# EAGLE schematic ENERGIS_Rack-PDU_1.0.0 (EAGLE 9.2.1)

## Sheet 1 of 6: MICROCONTROLLER
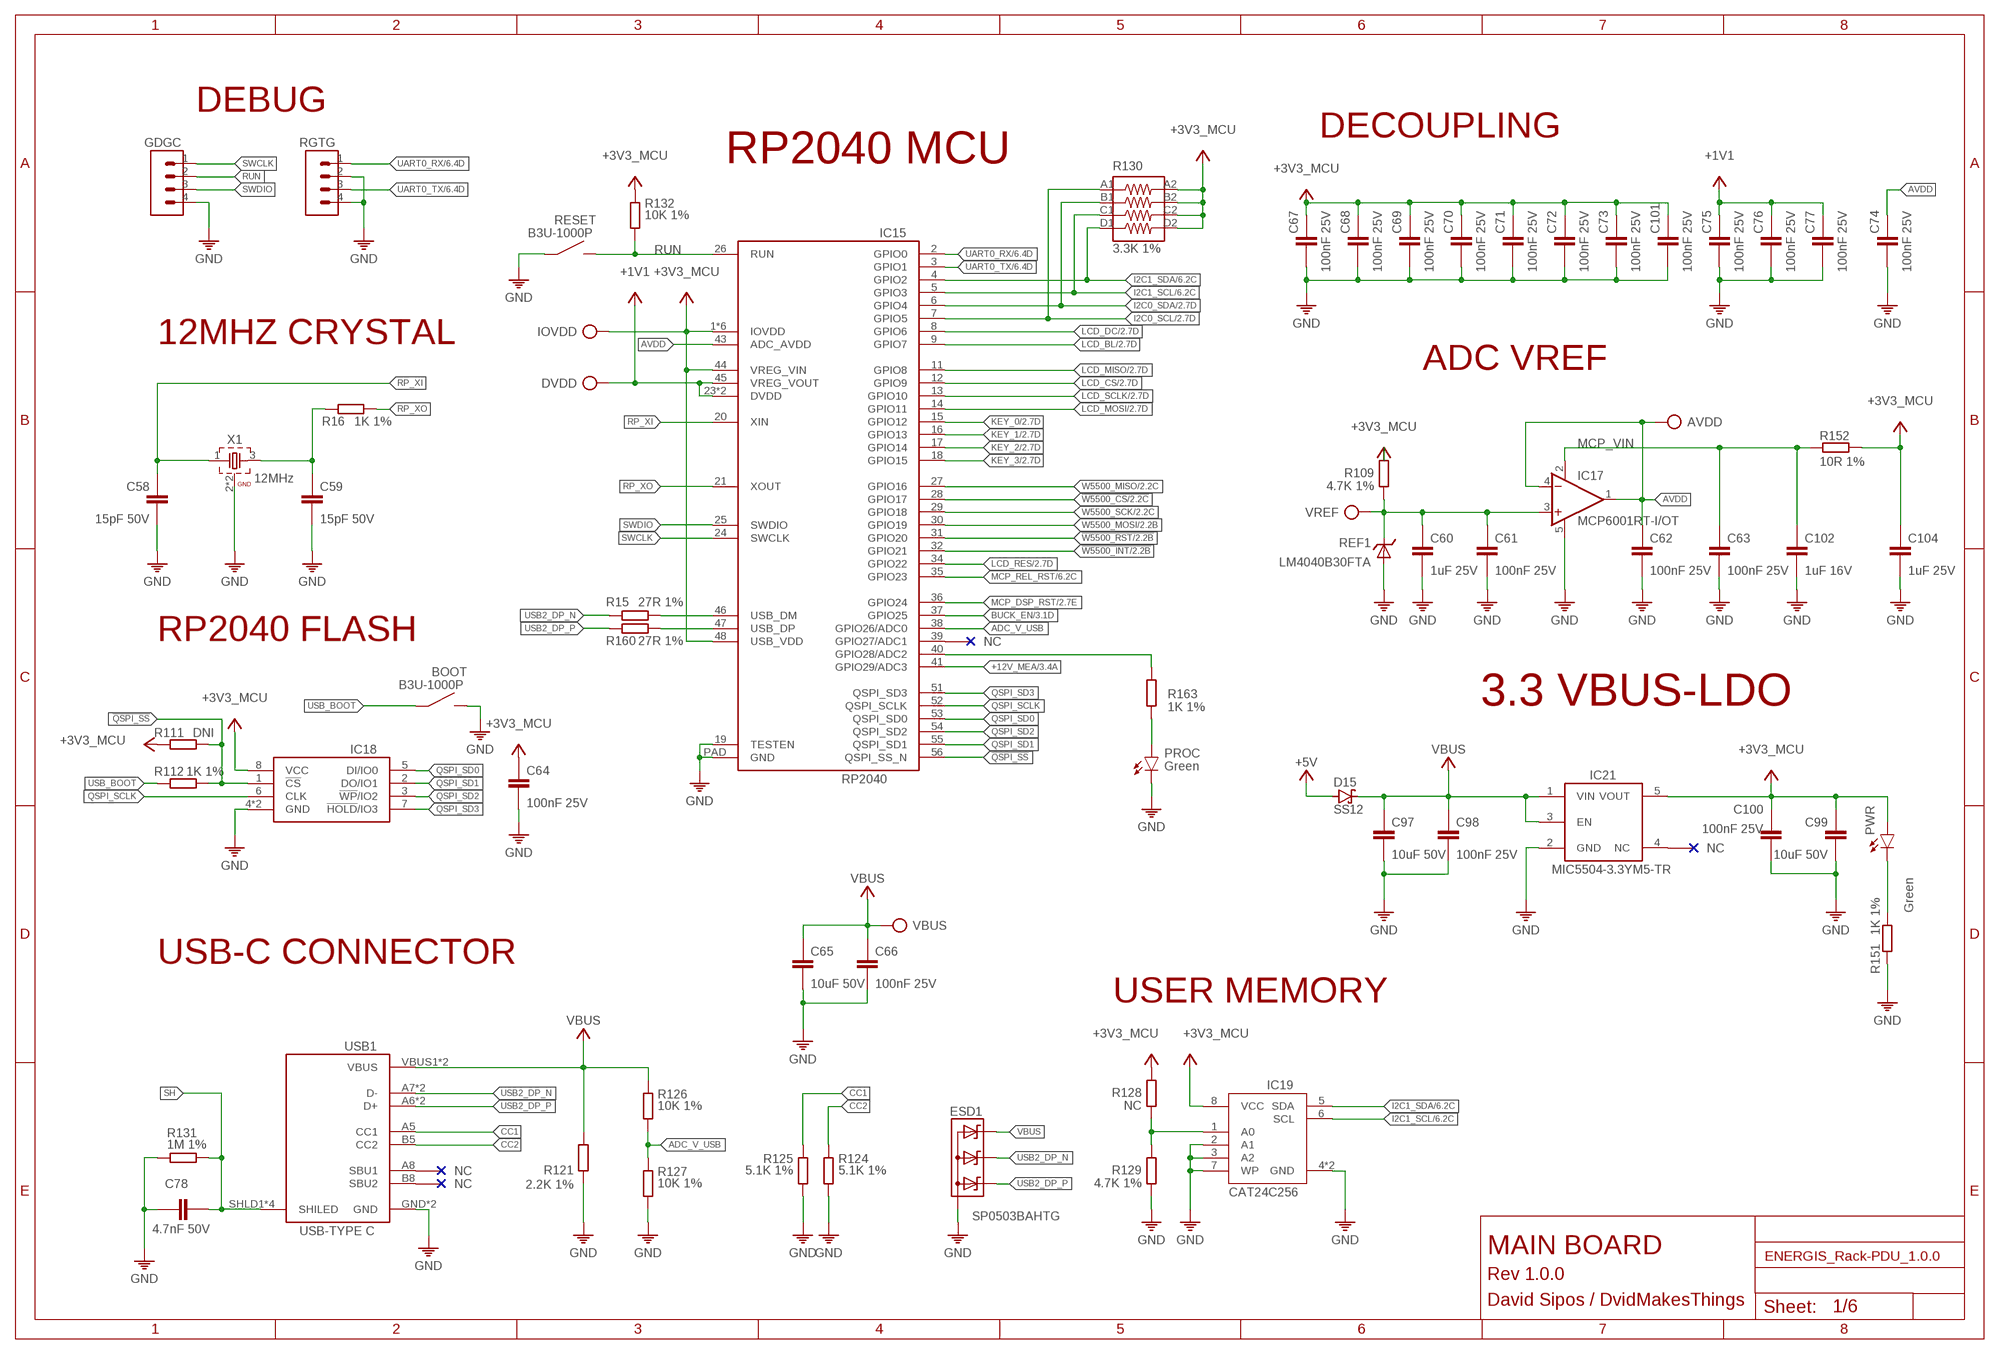
[diagram p0: schematic, sheet 1]

### Parts
AVDD  TP  [TP]
BOOT  B3U-1000P  B3U-1000P  [B3U-1000P]
C58  15pF 50V  15PF-50V0201  [0201]
C59  15pF 50V  15PF-50V0201  [0201]
C60  1uF 25V  1UF-25V0402  [0402]
C61  100nF 25V  100NF-25V-0201  [0201]
C62  100nF 25V  100NF-25V-0201  [0201]
C63  100nF 25V  100NF-25V-0201  [0201]
C64  100nF 25V  100NF-25V-0201  [0201]
C65  10uF 50V  10UF-50V-0805  [0805]
C66  100nF 25V  100NF-25V-0402  [0402]
C67  100nF 25V  100NF-25V-0201  [0201]
C68  100nF 25V  100NF-25V-0201  [0201]
C69  100nF 25V  100NF-25V-0201  [0201]
C70  100nF 25V  100NF-25V-0201  [0201]
C71  100nF 25V  100NF-25V-0201  [0201]
C72  100nF 25V  100NF-25V-0201  [0201]
C73  100nF 25V  100NF-25V-0201  [0201]
C74  100nF 25V  100NF-25V-0201  [0201]
C75  100nF 25V  100NF-25V-0201  [0201]
C76  100nF 25V  100NF-25V-0201  [0201]
C77  100nF 25V  100NF-25V-0201  [0201]
C78  4.7nF 50V  4.7NF-50V0402  [0402]
C97  10uF 50V  10UF-50V-0805  [0805]
C98  100nF 25V  100NF-25V-0201  [0201]
C99  10uF 50V  10UF-50V-0805  [0805]
C100  100nF 25V  100NF-25V-0201  [0201]
C101  100nF 25V  100NF-25V-0201  [0201]
C102  1uF 16V  1UF-16V0201  [0201]
C104  1uF 25V  1UF-25V0402  [0402]
D15  SS12  [SMA/DO-214AC]
DVDD  TP  [TP]
ESD1  SP0503BAHTG  SP0503BAHT  [SOT143]
GDGC  CON-1X4  [1X4]
IC15  RP2040  [QFN56]
IC17  MCP6001RT-I/OT  MCP6001RT  [SOT23-5]
IC18  W25Q128JVPIQ  W25Q128JVP  [SON127P600X500X75-8N]
IC19  CAT24C256HU4IGT3  CAT24C256-HU4  [SON50P300X200X50-9T130X140N]
IC21  MIC5504-3.3YM5  MIC5504-3.3YM5-TR  [SOT23-5]
IOVDD  TP  [TP]
PROC  Green  LED-GREENLED-0603  [LED-0603]
PWR  Green  LED-GREENLED-0603  [LED-0603]
R15  27R 1%  27R-1%0201  [0201]
R16  1K 1%  1K-1%0201  [0201]
R109  4.7K 1%  4.7K-1%0201  [0201]
R111  DNI  R0201  [R0201]
R112  1K 1%  1K-1%0402  [0402]
R121  2.2K 1%  2.2K-1%0201  [0201]
R124  5.1K 1%  5.1K-1%0201  [0201]
R125  5.1K 1%  5.1K-1%0201  [0201]
R126  10K 1%  10K-1%0201  [0201]
R127  10K 1%  10K-1%0201  [0201]
R128  NC  R0201  [R0201]
R129  4.7K 1%  4.7K-1%0201  [0201]
R130  3.3K 1%  3.3K-1%_ARRAY0603X4-1206  [_0603X4-1206]
R131  1M 1%  1M-1%0402  [0402]
R132  10K 1%  10K-1%0402  [0402]
R151  1K 1%  1K-1%0402  [0402]
R152  10R 1%  10R-1%0201  [0201]
R160  27R 1%  27R-1%0201  [0201]
R163  1K 1%  1K-1%0402  [0402]
REF1  LM4040B30FTA  LM4040BXX  [SOT23]
RESET  B3U-1000P  B3U-1000P  [B3U-1000P]
RGTG  CON-1X4  [1X4]
USB1  USB-TYPE-C-018  USB_C-THT  [USB-C]
VBUS  TP  [TP]
VREF  TP  [TP]
X1  12MHz  CRYSTAL-3225X322512MSB4SI  [WE-XTAL_CFPX-180]

### Nets
!QSPI_SS: IC15.56(QSPI_SS_N) IC18.1(!CS) R111.1 R112.2
!W5500_CS: IC15.28(GPIO17) ; also sheet 2
!W5500_INT: IC15.32(GPIO21) ; also sheet 2
!W5500_RST: IC15.31(GPIO20) ; also sheet 2
+1V1: C75.1 C76.1 C77.1 DVDD.TP IC15.23(DVDD) IC15.45(VREG_VOUT) IC15.50(DVDD)
+3V3_MCU: C64.1 C67.1 C68.1 C69.1 C70.1 C71.1 C72.1 C73.1 C99.1 C100.1 C101.1 C104.1 IC15.1(IOVDD) IC15.10(IOVDD) IC15.22(IOVDD) IC15.33(IOVDD) IC15.42(IOVDD) IC15.44(VREG_VIN) IC15.48(USB_VDD) IC15.49(IOVDD) IC18.8(VCC) IC19.8(VCC) IC21.5(VOUT) IOVDD.TP PWR.A R109.2 R111.2 R128.2 R130.A2 R130.B2 R130.C2 R130.D2 R132.1 R152.1
+5V: D15.A ; also sheet 2,3
+12V_MEA: IC15.41(GPIO29/ADC3) ; also sheet 3
ADC_V_USB: IC15.38(GPIO26/ADC0) R126.2 R127.1
AVDD: AVDD.TP C62.1 C74.1 IC15.43(ADC_AVDD) IC17.1(OUT) IC17.4(-IN)
BUCK_EN: IC15.37(GPIO25) ; also sheet 3
CC1: R125.1 USB1.A5(CC1)
CC2: R124.1 USB1.B5(CC2)
GND: BOOT.2 C58.2 C59.2 C60.2 C61.2 C62.2 C63.2 C64.2 C65.2 C66.2 C67.2 C68.2 C69.2 C70.2 C71.2 C72.2 C73.2 C74.2 C75.2 C76.2 C77.2 C78.2 C97.2 C98.2 C99.2 C100.2 C101.2 C102.2 C104.2 ESD1.1(A) GDGC.4 IC15.19(TESTEN) IC15.PAD(GND) IC17.5(V-) IC18.4(GND) IC18.PAD(GND) IC19.2(A1) IC19.3(A2) IC19.4(GND) IC19.7(WP) IC19.9(GND) IC21.2(GND) PROC.C R121.2 R124.2 R125.2 R127.2 R129.1 R131.2 R151.1 REF1.2(A) REF1.3(A) RESET.1 RGTG.2 RGTG.4 USB1.GND USB1.GND2(GND) X1.2(GND) X1.4(GND) ; also sheet 2,3,6
I2C0_SCL: IC15.7(GPIO5) R130.A1 ; also sheet 2
I2C0_SDA: IC15.6(GPIO4) R130.B1 ; also sheet 2
I2C1_SCL: IC15.5(GPIO3) IC19.6(SCL) R130.C1 ; also sheet 6
I2C1_SDA: IC15.4(GPIO2) IC19.5(SDA) R130.D1 ; also sheet 6
KEY_0: IC15.15(GPIO12) ; also sheet 2
KEY_1: IC15.16(GPIO13) ; also sheet 2
KEY_2: IC15.17(GPIO14) ; also sheet 2
KEY_3: IC15.18(GPIO15) ; also sheet 2
LCD_BL: IC15.9(GPIO7) ; also sheet 2
LCD_CS: IC15.12(GPIO9) ; also sheet 2
LCD_DC: IC15.8(GPIO6) ; also sheet 2
LCD_MISO: IC15.11(GPIO8) ; also sheet 2
LCD_MOSI: IC15.14(GPIO11) ; also sheet 2
LCD_RES: IC15.34(GPIO22) ; also sheet 2
LCD_SCLK: IC15.13(GPIO10) ; also sheet 2
MCP_DSP_RST: IC15.36(GPIO24) ; also sheet 2
MCP_REL_RST: IC15.35(GPIO23) ; also sheet 6
MCP_VIN: C63.1 C102.1 IC17.2(V+) R152.2
N$17: IC15.40(GPIO28/ADC2) R163.2
N$19: PROC.A R163.1
N$53: C59.1 R16.1 X1.3
N$54: IC19.1(A0) R128.1 R129.2
N$112: PWR.C R151.2
QSPI_SCLK: IC15.52(QSPI_SCLK) IC18.6(CLK)
QSPI_SD0: IC15.53(QSPI_SD0) IC18.5(DI/IO0)
QSPI_SD1: IC15.55(QSPI_SD1) IC18.2(DO/IO1)
QSPI_SD2: IC15.54(QSPI_SD2) IC18.3(!WP!/IO2)
QSPI_SD3: IC15.51(QSPI_SD3) IC18.7(!HOLD!/IO3)
RP_DP_N [90R_DIFFPAIR]: IC15.46(USB_DM) R15.2
RP_DP_P [90R_DIFFPAIR]: IC15.47(USB_DP) R160.2
RP_XI: C58.1 IC15.20(XIN) X1.1
RP_XO: IC15.21(XOUT) R16.2
RUN: GDGC.2 IC15.26(RUN) R132.2 RESET.2
SH: C78.1 R131.1 USB1.SHLD1(SHILED) USB1.SHLD2(SHILED) USB1.SHLD3(SHILED) USB1.SHLD4(SHILED) ; also sheet 2
SWCLK: GDGC.1 IC15.24(SWCLK)
SWDIO: GDGC.3 IC15.25(SWDIO)
UART0_RX: IC15.2(GPIO0) RGTG.1 ; also sheet 6
UART0_TX: IC15.3(GPIO1) RGTG.3 ; also sheet 6
USB2_DP_N [90R_DIFFPAIR]: ESD1.3(C2) R15.1 USB1.A7(D-) USB1.B7(D-)
USB2_DP_P [90R_DIFFPAIR]: ESD1.2(C1) R160.1 USB1.A6(D+) USB1.B6(D+)
USB_BOOT: BOOT.1 R112.1
VBUS: C65.1 C66.1 C97.1 C98.1 D15.C ESD1.4(C3) IC21.1(VIN) IC21.3(EN) R121.1 R126.1 USB1.VBUS1(VBUS) USB1.VBUS2(VBUS) VBUS.TP
VREF: C60.1 C61.1 IC17.3(+IN) R109.1 REF1.1(C) VREF.TP
W5500_MISO: IC15.27(GPIO16) ; also sheet 2
W5500_MOSI: IC15.30(GPIO19) ; also sheet 2
W5500_SCK: IC15.29(GPIO18) ; also sheet 2
Unconnected: IC15.39(GPIO27/ADC1) IC21.4(NC) USB1.A8(SBU1) USB1.B8(SBU2)

### Notes on the sheet
- DEBUG
- DECOUPLING
- RP2040 MCU
- 12MHZ CRYSTAL
- ADC VREF
- RP2040 FLASH
- 3.3 VBUS-LDO
- USB-C CONNECTOR
- USER MEMORY
- MAIN BOARD
- Rev 1.0.0
- David Sipos / DvidMakesThings

## Sheet 2 of 6: NETWORK AND CONNECTORS
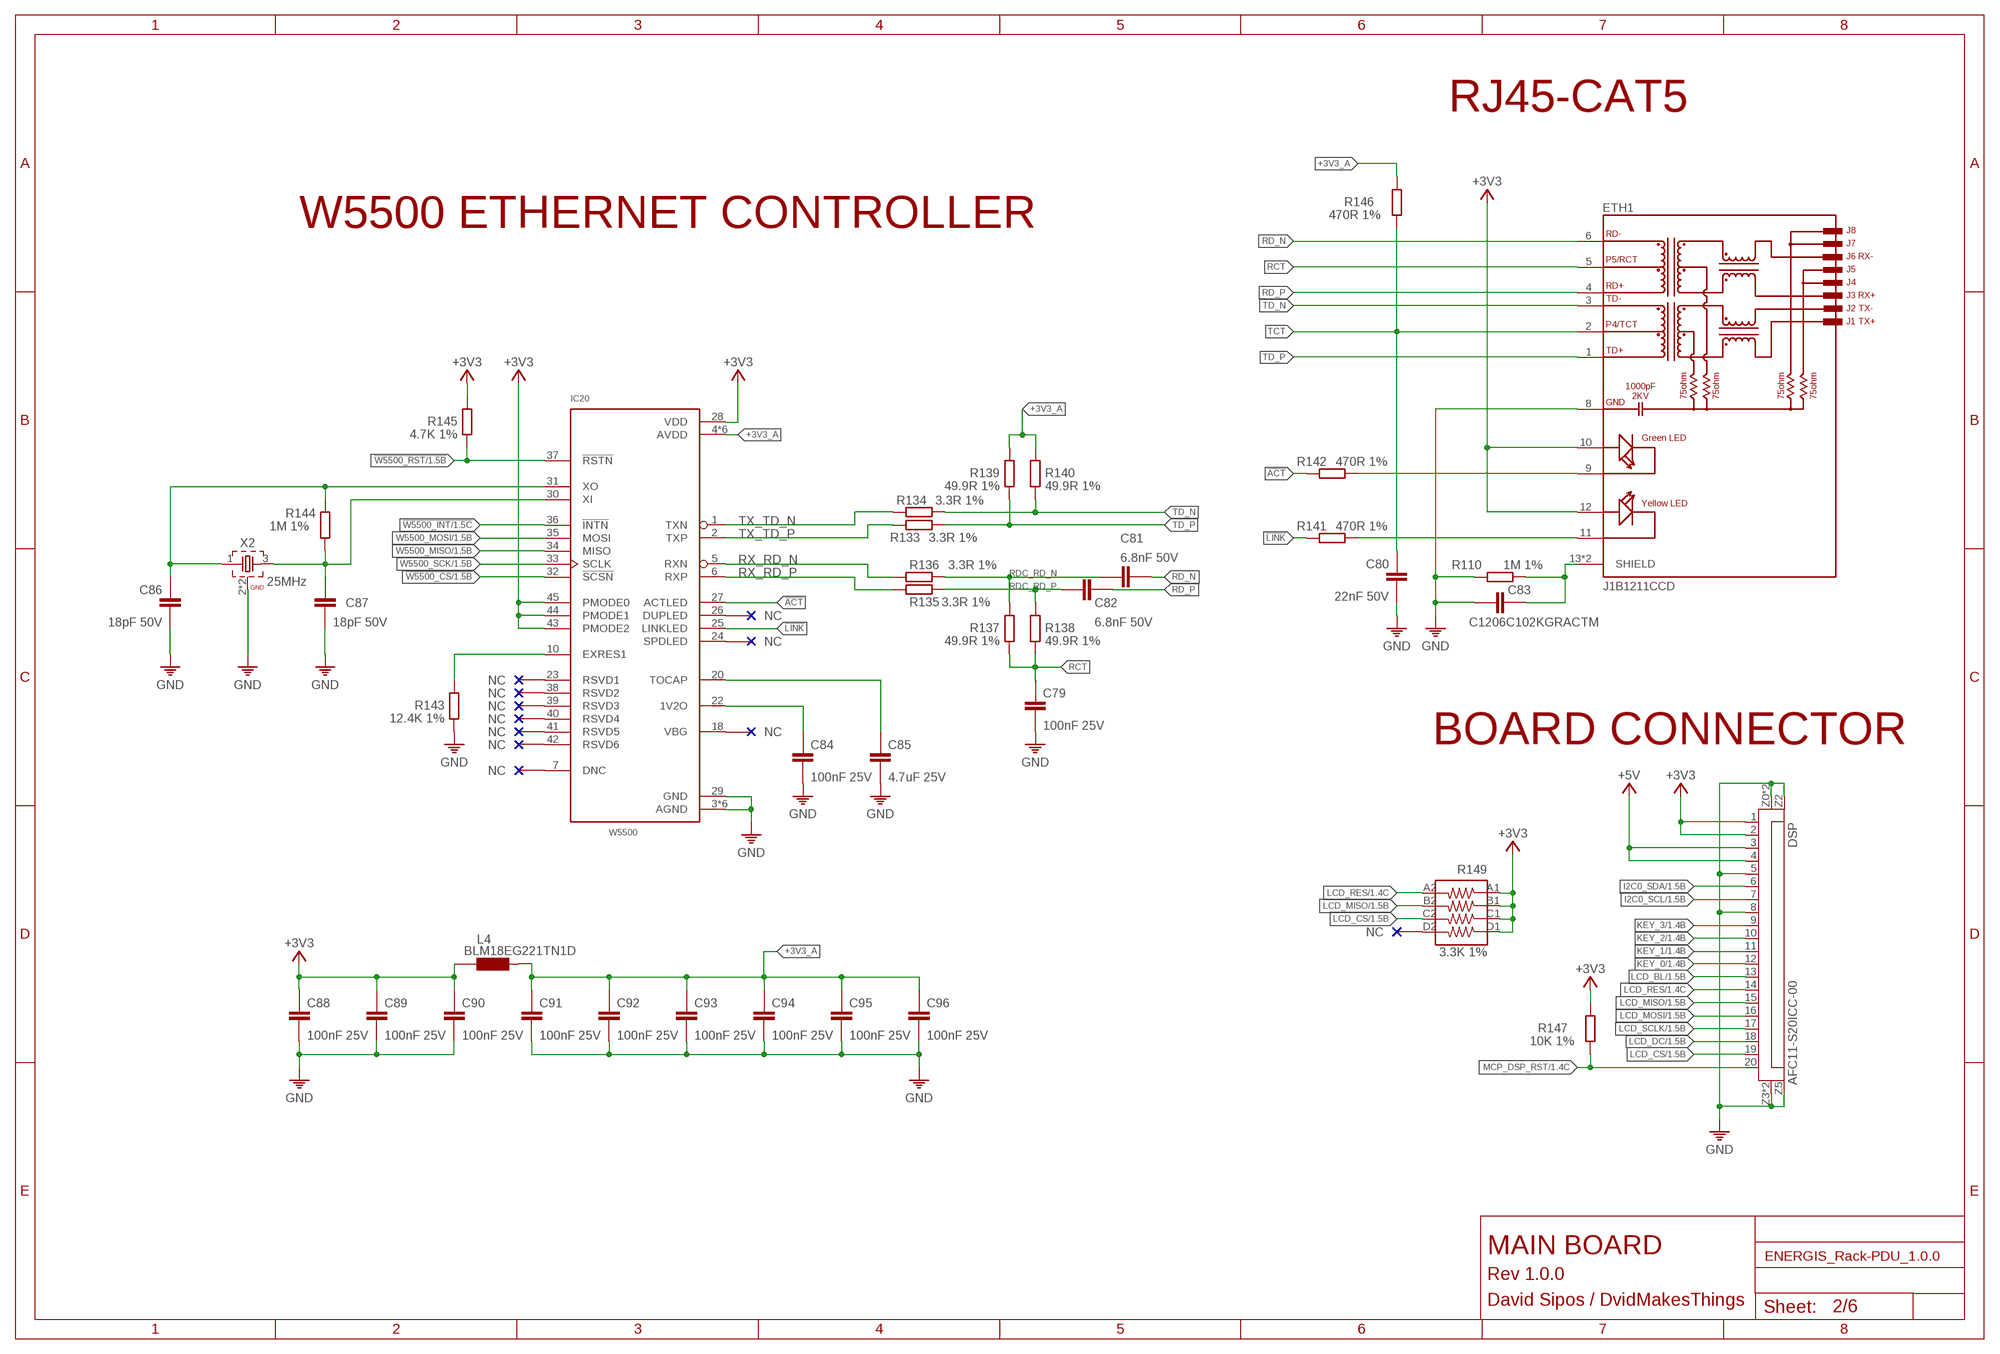
[diagram p1: schematic, sheet 2]

### Parts
C79  100nF 25V  100NF-25V-0402  [0402]
C80  22nF 50V  22NF-50V0402  [0402]
C81  6.8nF 50V  6.8NF-50V0201  [0201]
C82  6.8nF 50V  6.8NF-50V0201  [0201]
C83  C1206C102KGRACTM  C-1206  [C1206]
C84  100nF 25V  100NF-25V-0201  [0201]
C85  4.7uF 25V  4.7UF-25V0402  [0402]
C86  18pF 50V  18PF-50V-0201  [0201]
C87  18pF 50V  18PF-50V-0201  [0201]
C88  100nF 25V  100NF-25V-0201  [0201]
C89  100nF 25V  100NF-25V-0201  [0201]
C90  100nF 25V  100NF-25V-0201  [0201]
C91  100nF 25V  100NF-25V-0201  [0201]
C92  100nF 25V  100NF-25V-0201  [0201]
C93  100nF 25V  100NF-25V-0201  [0201]
C94  100nF 25V  100NF-25V-0201  [0201]
C95  100nF 25V  100NF-25V-0201  [0201]
C96  100nF 25V  100NF-25V-0201  [0201]
DSP  AFC11-S20ICC-00  AFC11-S20ICC-00  [FPC20]
ETH1  J1B1211CCD  [J1B1211CCD]
IC20  W5500  [LQFP48]
L4  BLM18EG221TN1D  [0603]
R110  1M 1%  1M-1%1206  [1206]
R133  3.3R 1%  3.3R-1%0201  [0201]
R134  3.3R 1%  3.3R-1%0201  [0201]
R135  3.3R 1%  3.3R-1%0201  [0201]
R136  3.3R 1%  3.3R-1%0201  [0201]
R137  49.9R 1%  49.9R-1%0201  [0201]
R138  49.9R 1%  49.9R-1%0201  [0201]
R139  49.9R 1%  49.9R-1%0201  [0201]
R140  49.9R 1%  49.9R-1%0201  [0201]
R141  470R 1%  470R-1%0402  [0402]
R142  470R 1%  470R-1%0402  [0402]
R143  12.4K 1%  R0201  [R0201]
R144  1M 1%  1M-1%0201  [0201]
R145  4.7K 1%  4.7K-1%0201  [0201]
R146  470R 1%  470R-1%0402  [0402]
R147  10K 1%  10K-1%0402  [0402]
R149  3.3K 1%  3.3K-1%_ARRAY0603X4-1206  [_0603X4-1206]
X2  25MHz  CRYSTAL-3225X322525MOB4SI  [WE-XTAL_CFPX-180]

### Nets
!ACT: IC20.27(ACTLED) R142.1
!LINK: IC20.25(LINKLED) R141.1
!W5500_CS: IC20.32(!SCSN) ; also sheet 1
!W5500_INT: IC20.36(!INTN) ; also sheet 1
!W5500_RST: IC20.37(!RSTN) R145.1 ; also sheet 1
+3V3: C88.1 C89.1 C90.1 DSP.1 DSP.2 ETH1.10(GREEN+) ETH1.12(YELLOW+) IC20.28(VDD) IC20.43(PMODE2) IC20.44(PMODE1) IC20.45(PMODE0) L4.1 R145.2 R147.2 R149.A1 R149.B1 R149.C1 R149.D1 ; also sheet 3,6
+3V3_A: C91.1 C92.1 C93.1 C94.1 C95.1 C96.1 IC20.4(AVDD) IC20.8(AVDD) IC20.11(AVDD) IC20.15(AVDD) IC20.17(AVDD) IC20.21(AVDD) L4.2 R139.2 R140.2 R146.2
+5V: DSP.3 DSP.4 ; also sheet 1,3
GND: C79.2 C80.2 C83.1 C84.2 C85.2 C86.2 C87.2 C88.2 C89.2 C90.2 C91.2 C92.2 C93.2 C94.2 C95.2 C96.2 DSP.5 DSP.8 DSP.Z0(Z1) DSP.Z1 DSP.Z2 DSP.Z3 DSP.Z4(Z3) DSP.Z5(Z4) ETH1.8(GND) IC20.3(AGND) IC20.9(AGND) IC20.14(AGND) IC20.16(AGND) IC20.19(AGND) IC20.29(GND) IC20.48(AGND) R110.1 R143.1 X2.2(GND) X2.4(GND) ; also sheet 1,3,6
I2C0_SCL: DSP.7 ; also sheet 1
I2C0_SDA: DSP.6 ; also sheet 1
KEY_0: DSP.12 ; also sheet 1
KEY_1: DSP.11 ; also sheet 1
KEY_2: DSP.10 ; also sheet 1
KEY_3: DSP.9 ; also sheet 1
LCD_BL: DSP.13 ; also sheet 1
LCD_CS: DSP.19 R149.C2 ; also sheet 1
LCD_DC: DSP.18 ; also sheet 1
LCD_MISO: DSP.15 R149.B2 ; also sheet 1
LCD_MOSI: DSP.16 ; also sheet 1
LCD_RES: DSP.14 R149.A2 ; also sheet 1
LCD_SCLK: DSP.17 ; also sheet 1
MCP_DSP_RST: DSP.20 R147.1 ; also sheet 1
N$82: ETH1.11(YELLOW-) R141.2
N$91: ETH1.9(GREEN-) R142.2
N$92: IC20.10(EXRES1) R143.2
N$93: C84.1 IC20.22(1V2O)
N$94: C85.1 IC20.20(TOCAP)
N$101: C87.1 IC20.30(XI) R144.1 X2.3
RCT: C79.1 ETH1.5(P5/RCT) R137.1 R138.1
RD_N [100R_DIFFPAIR]: C81.2 ETH1.6(RD-)
RD_P [100R_DIFFPAIR]: C82.2 ETH1.4(RD+)
RDC_RD_N [100R_DIFFPAIR]: C81.1 R136.2 R137.2
RDC_RD_P [100R_DIFFPAIR]: C82.1 R135.2 R138.2
RX_RD_N [100R_DIFFPAIR]: IC20.5(RXN) R136.1
RX_RD_P [100R_DIFFPAIR]: IC20.6(RXP) R135.1
SH: C83.2 ETH1.13(SHIELD) ETH1.14(SHIELD) R110.2 ; also sheet 1
TCT: C80.1 ETH1.2(P4/TCT) R146.1
TD_N [100R_DIFFPAIR]: ETH1.3(TD-) R134.2 R140.1
TD_P [100R_DIFFPAIR]: ETH1.1(TD+) R133.2 R139.1
TX_TD_N [100R_DIFFPAIR]: IC20.1(TXN) R134.1
TX_TD_P [100R_DIFFPAIR]: IC20.2(TXP) R133.1
W5500_MISO: IC20.34(MISO) ; also sheet 1
W5500_MOSI: IC20.35(MOSI) ; also sheet 1
W5500_SCK: IC20.33(SCLK) ; also sheet 1
XO: C86.1 IC20.31(XO) R144.2 X2.1
Unconnected: IC20.7(DNC) IC20.18(VBG) IC20.23(RSVD1) IC20.24(SPDLED) IC20.26(DUPLED) IC20.38(RSVD2) IC20.39(RSVD3) IC20.40(RSVD4) IC20.41(RSVD5) IC20.42(RSVD6) R149.D2

### Notes on the sheet
- RJ45-CAT5
- W5500 ETHERNET CONTROLLER
- BOARD CONNECTOR
- MAIN BOARD
- Rev 1.0.0
- David Sipos / DvidMakesThings

## Sheet 3 of 6: POWER
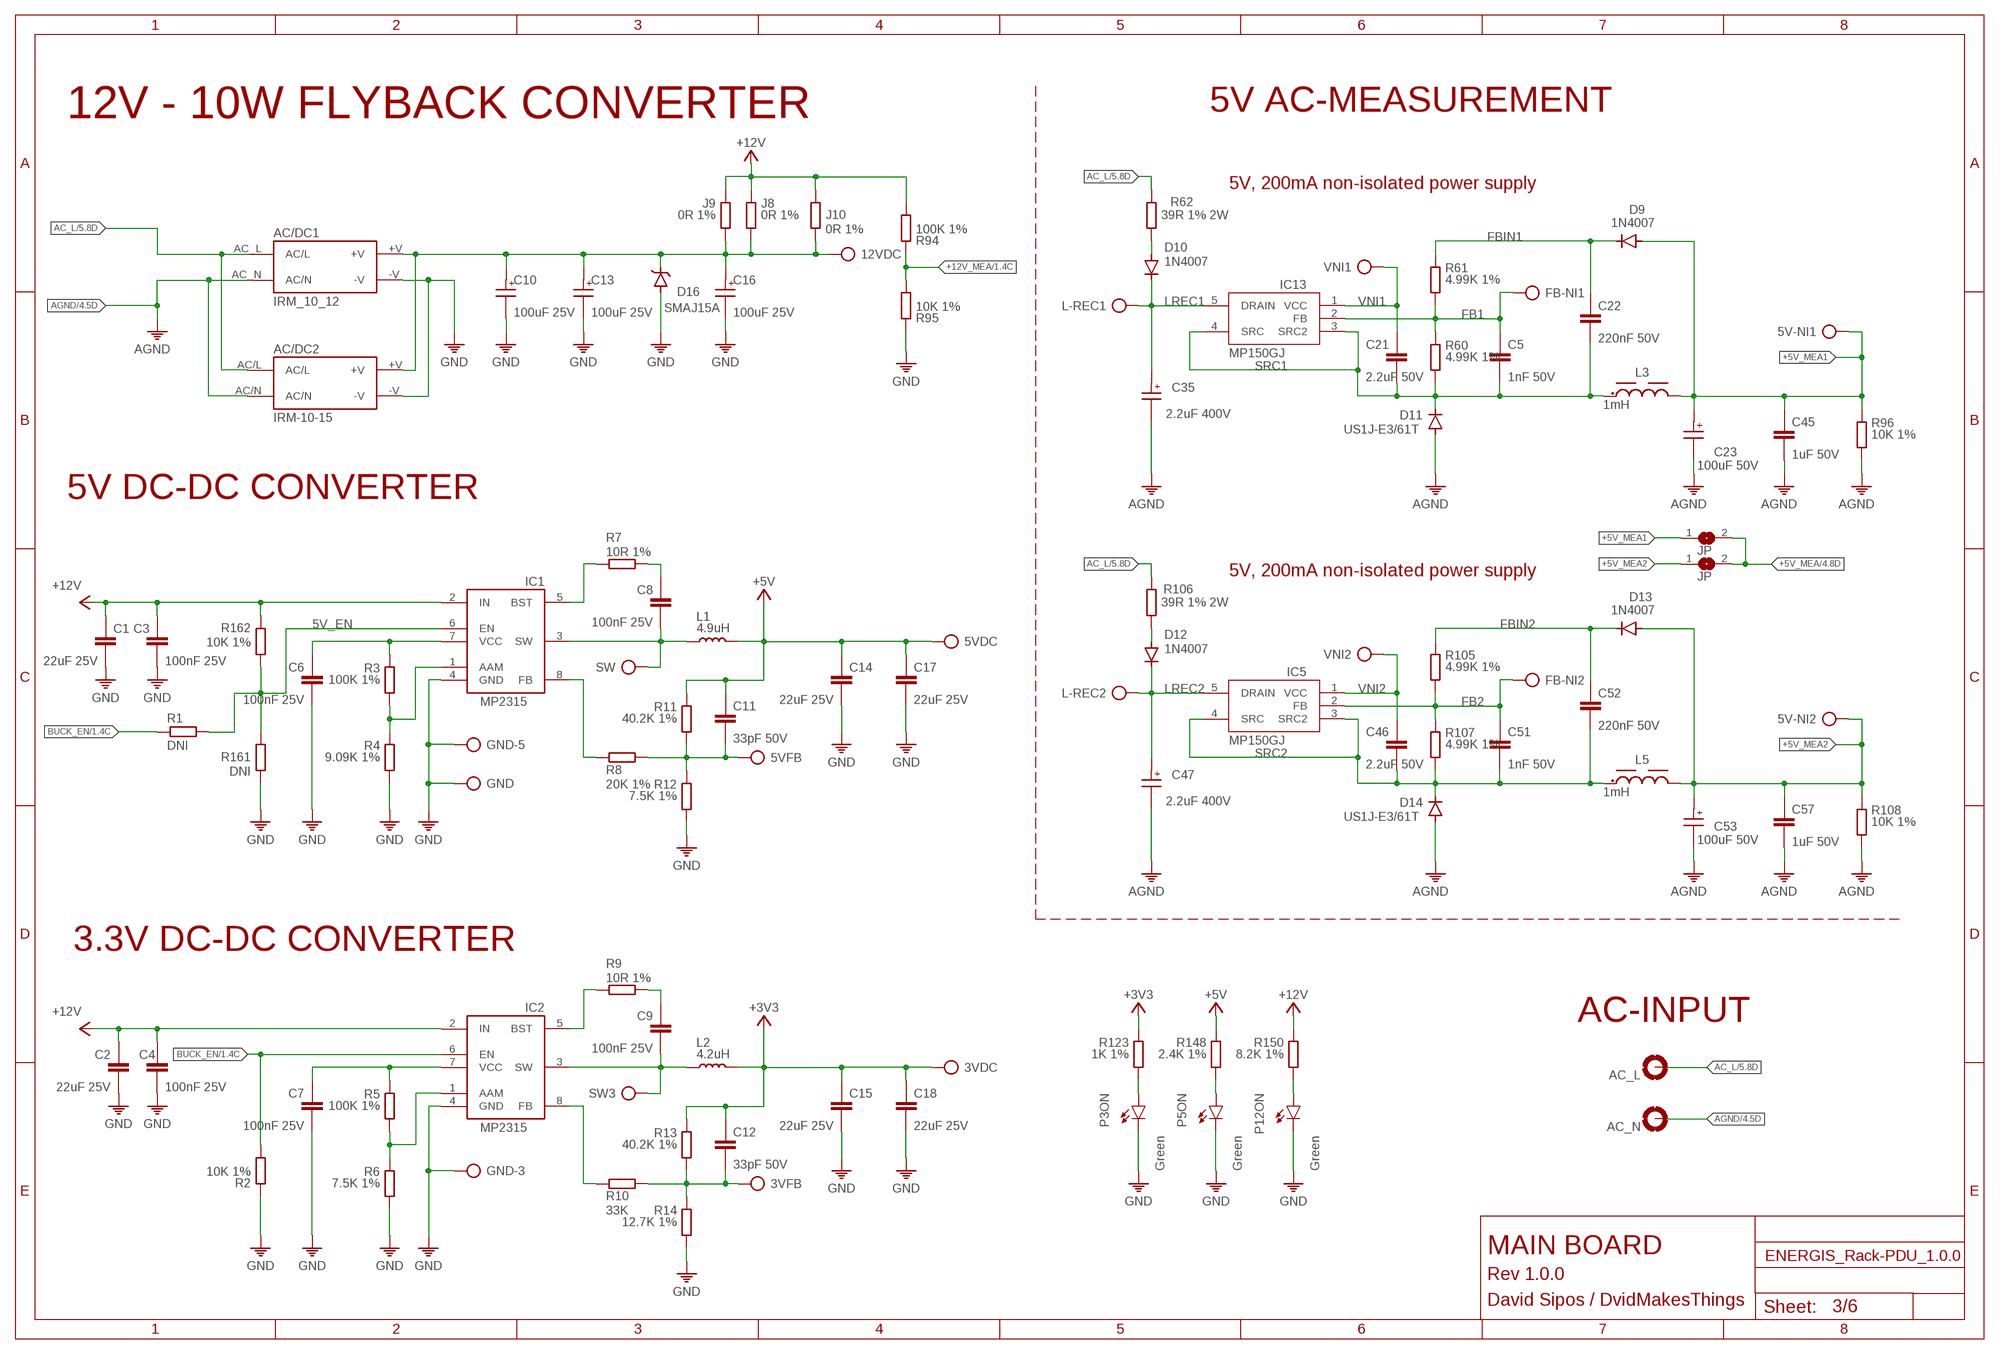
[diagram p2: schematic, sheet 3]

### Parts
3VDC  TP  [TP]
3VFB  TP  [TP]
5V-NI1  TP  [TP]
5V-NI2  TP  [TP]
5VDC  TP  [TP]
5VFB  TP  [TP]
12VDC  TP  [TP]
AC/DC1  IRM_10_12  [IRM_10_12]
AC/DC2  IRM-10-15  IRM_10_12-2  [IRM_15_12]
AC_L  MOUNT-PAD-ROUND3.0  [3,0-PAD]
AC_N  MOUNT-PAD-ROUND3.0  [3,0-PAD]
C1  22uF 25V  22UF-25V-1206  [1206]
C2  22uF 25V  22UF-25V-1206  [1206]
C3  100nF 25V  100NF-25V-0402  [0402]
C4  100nF 25V  100NF-25V-0402  [0402]
C5  1nF 50V  1NF-50V-0603  [0603]
C6  100nF 25V  100NF-25V-0402  [0402]
C7  100nF 25V  100NF-25V-0402  [0402]
C8  100nF 25V  100NF-25V-0402  [0402]
C9  100nF 25V  100NF-25V-0402  [0402]
C10  100uF 25V  100UF-25V6.3X7.7(DXL)  [6.3X7.7(DXL)]
C11  33pF 50V  33PF-50V0402  [0402]
C12  33pF 50V  33PF-50V0402  [0402]
C13  100uF 25V  100UF-25V6.3X7.7(DXL)  [6.3X7.7(DXL)]
C14  22uF 25V  22UF-25V-1206  [1206]
C15  22uF 25V  22UF-25V-1206  [1206]
C16  100uF 25V  100UF-25V6.3X7.7(DXL)  [6.3X7.7(DXL)]
C17  22uF 25V  22UF-25V-1206  [1206]
C18  22uF 25V  22UF-25V-1206  [1206]
C21  2.2uF 50V  2.2UF-50V0603  [0603]
C22  220nF 50V  220NF-50V0805  [0805]
C23  100uF 50V  100UF-50V6.3X7.7(DXL)  [6.3X7.7(DXL)]
C35  2.2uF 400V  2.2UF-400V6.3X7.7(DXL)  [6.3X7.7(DXL)]
C45  1uF 50V  1UF-50V0805  [0805]
C46  2.2uF 50V  2.2UF-50V0603  [0603]
C47  2.2uF 400V  2.2UF-400V6.3X7.7(DXL)  [6.3X7.7(DXL)]
C51  1nF 50V  1NF-50V-0603  [0603]
C52  220nF 50V  220NF-50V0805  [0805]
C53  100uF 50V  100UF-50V6.3X7.7(DXL)  [6.3X7.7(DXL)]
C57  1uF 50V  1UF-50V0805  [0805]
D9  1N4007  [SMA/DO-214AC]
D10  1N4007  [SMA/DO-214AC]
D11  US1J-E3/61T  US1J-E3/61T  [SMA/DO-214AC]
D12  1N4007  [SMA/DO-214AC]
D13  1N4007  [SMA/DO-214AC]
D14  US1J-E3/61T  US1J-E3/61T  [SMA/DO-214AC]
D16  SMAJ15A  [SMA/DO-214AC]
FB-NI1  TP  [TP]
FB-NI2  TP  [TP]
GND  TP  [TP]
GND-3  TP  [TP]
GND-5  TP  [TP]
IC1  MP2315GJ-Z  MP2315TSOT23-8  [SOT65P280X110-8N]
IC2  MP2315GJ-Z  MP2315TSOT23-8  [SOT65P280X110-8N]
IC5  MP150GJ  [SOT23-5]
IC13  MP150GJ  [SOT23-5]
J2  JP  SJ  [SJ]
J7  JP  SJ  [SJ]
J8  0R 1%  0R0805  [0805]
J9  0R 1%  0R0805  [0805]
J10  0R 1%  0R0805  [0805]
L1  4.9uH  L  [SRR5228A]
L2  4.2uH  L  [SRR5228A]
L3  1mH  1MHL-6.6X6.6  [L-6.6X6.6]
L5  1mH  1MHL-6.6X6.6  [L-6.6X6.6]
L-REC1  TP  [TP]
L-REC2  TP  [TP]
P3ON  Green  LED-GREENLED-0603  [LED-0603]
P5ON  Green  LED-GREENLED-0603  [LED-0603]
P12ON  Green  LED-GREENLED-0603  [LED-0603]
R1  DNI  R0402  [0402]
R2  10K 1%  10K-1%0402  [0402]
R3  100K 1%  100K-1%0402  [0402]
R4  9.09K 1%  9.09K-1%0402  [0402]
R5  100K 1%  100K-1%0402  [0402]
R6  7.5K 1%  7.5K-1%0402  [0402]
R7  10R 1%  10R-1%0402  [0402]
R8  20K 1%  20K-1%0402  [0402]
R9  10R 1%  10R-1%0402  [0402]
R10  33K  R0402  [0402]
R11  40.2K 1%  40.2K-1%0402  [0402]
R12  7.5K 1%  7.5K-1%0402  [0402]
R13  40.2K 1%  40.2K-1%0402  [0402]
R14  12.7K 1%  12.7K-1%0402  [0402]
R60  4.99K 1%  4.99K-1%0603  [0603]
R61  4.99K 1%  4.99K-1%0603  [0603]
R62  39R 1% 2W  39R-1%2512  [2512]
R94  100K 1%  100K-1%0402  [0402]
R95  10K 1%  10K-1%0402  [0402]
R96  10K 1%  10K-1%0805  [0805]
R105  4.99K 1%  4.99K-1%0603  [0603]
R106  39R 1% 2W  39R-1%2512  [2512]
R107  4.99K 1%  4.99K-1%0603  [0603]
R108  10K 1%  10K-1%0805  [0805]
R123  1K 1%  1K-1%0402  [0402]
R148  2.4K 1%  2.4K-1%0402  [0402]
R150  8.2K 1%  8.2K-1%0402  [0402]
R161  DNI  R0402  [0402]
R162  10K 1%  10K-1%0402  [0402]
SW  TP  [TP]
SW3  TP  [TP]
VNI1  TP  [TP]
VNI2  TP  [TP]

### Nets
3VFB: 3VFB.TP C12.2 R10.2 R13.2 R14.1
5V_EN: IC1.6(EN) R1.1 R161.2 R162.1
5VFB: 5VFB.TP C11.2 R8.2 R11.2 R12.1
12VRAW: 12VDC.TP AC/DC1.+V AC/DC2.+V C10.1(+) C13.1(+) C16.1(+) D16.C J8.2 J9.2 J10.2
+3V3: 3VDC.TP C12.1 C15.1 C18.1 L2.2 R13.1 R123.1 ; also sheet 2,6
+5V: 5VDC.TP C11.1 C14.1 C17.1 L1.2 R11.1 R148.1 ; also sheet 1,2
+5V_MEA: J2.2 J7.2 ; also sheet 4,6
+5V_MEA1: 5V-NI1.TP C23.1(+) C45.2 D9.A J2.1 L3.2 R96.1
+5V_MEA2: 5V-NI2.TP C53.1(+) C57.2 D13.A J7.1 L5.2 R108.1
+12V: C1.1 C2.1 C3.1 C4.1 IC1.2(IN) IC2.2(IN) J8.1 J9.1 J10.1 R94.2 R150.1 R162.2 ; also sheet 5,6
+12V_MEA: R94.1 R95.2 ; also sheet 1
AC_L: AC/DC1.AC_L(AC/L) AC/DC2.AC/L AC_L.B3,0(MOUNT) R62.1 R106.1 ; also sheet 5
AGND: AC/DC1.AC_N(AC/N) AC/DC2.AC/N AC_N.B3,0(MOUNT) C23.2(-) C35.2(-) C45.1 C47.2(-) C53.2(-) C57.1 D11.A D14.A R96.2 R108.2 ; also sheet 4,6
BUCK_EN: IC2.6(EN) R1.2 R2.2 ; also sheet 1
FB1: C5.2 FB-NI1.TP IC13.2(FB) R60.1 R61.2
FB2: C51.2 FB-NI2.TP IC5.2(FB) R105.2 R107.1
FBIN1: C22.2 D9.C R61.1
FBIN2: C52.2 D13.C R105.1
GND: AC/DC1.-V AC/DC2.-V C1.2 C2.2 C3.2 C4.2 C6.2 C7.2 C10.2(-) C13.2(-) C14.2 C15.2 C16.2(-) C17.2 C18.2 D16.A GND-3.TP GND-5.TP GND.TP IC1.4(GND) IC2.4(GND) P3ON.C P5ON.C P12ON.C R2.1 R4.2 R6.2 R12.2 R14.2 R95.1 R161.1 ; also sheet 1,2,6
LREC1: C35.1(+) D10.C IC13.5(DRAIN) L-REC1.TP
LREC2: C47.1(+) D12.C IC5.5(DRAIN) L-REC2.TP
N$2: P3ON.A R123.2
N$3: D10.A R62.2
N$5: P5ON.A R148.2
N$9: P12ON.A R150.2
N$14: IC1.5(BST) R7.2
N$16: IC1.8(FB) R8.1
N$18: C8.1 R7.1
N$21: C6.1 IC1.7(VCC) R3.1
N$38: IC2.5(BST) R9.2
N$39: IC2.8(FB) R10.1
N$41: C9.1 R9.1
N$44: C7.1 IC2.7(VCC) R5.1
N$45: IC1.1(AAM) R3.2 R4.1
N$46: IC2.1(AAM) R5.2 R6.1
N$56: D12.A R106.2
SRC1: C5.1 C21.1 C22.1 D11.C IC13.3(SRC2) IC13.4(SRC) L3.1 R60.2
SRC2: C46.1 C51.1 C52.1 D14.C IC5.3(SRC2) IC5.4(SRC) L5.1 R107.2
SW3: C9.2 IC2.3(SW) L2.1 SW3.TP
SW5: C8.2 IC1.3(SW) L1.1 SW.TP
VNI1: C21.2 IC13.1(VCC) VNI1.TP
VNI2: C46.2 IC5.1(VCC) VNI2.TP

### Notes on the sheet
- 12V - 10W FLYBACK CONVERTER | 5V AC-MEASUREMENT
- 5V, 200mA non-isolated power supply
- 5V DC-DC CONVERTER
- 5V, 200mA non-isolated power supply
- 3.3V DC-DC CONVERTER
- AC-INPUT
- MAIN BOARD
- Rev 1.0.0
- David Sipos / DvidMakesThings

## Sheet 4 of 6: POWER MEASUREMENT
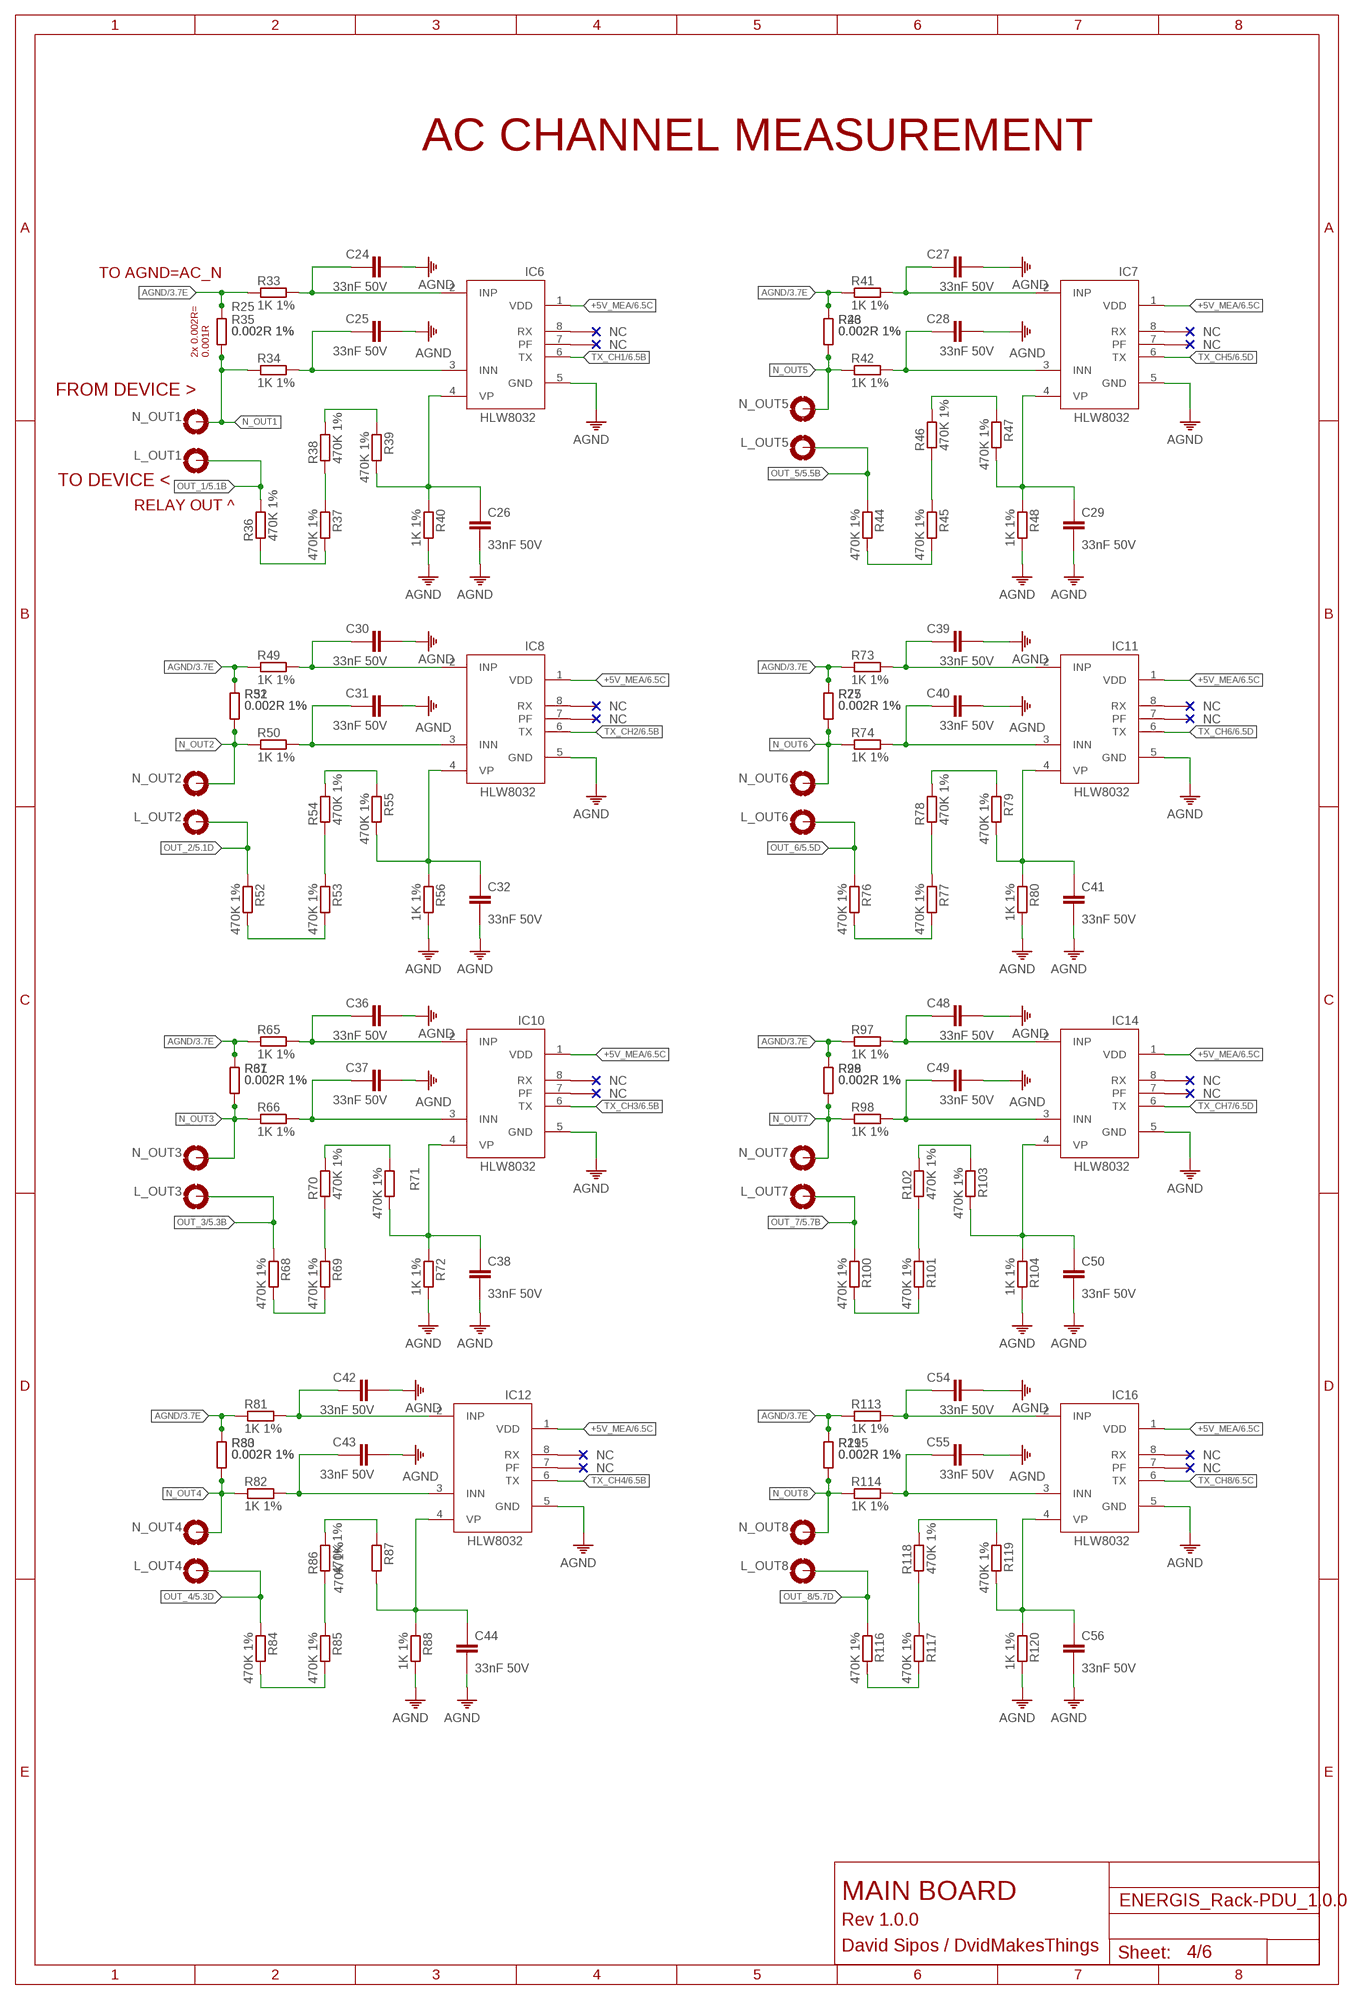
[diagram p3: schematic, sheet 4]

### Parts
C24  33nF 50V  33NF-50V0805  [0805]
C25  33nF 50V  33NF-50V0805  [0805]
C26  33nF 50V  33NF-50V0805  [0805]
C27  33nF 50V  33NF-50V0805  [0805]
C28  33nF 50V  33NF-50V0805  [0805]
C29  33nF 50V  33NF-50V0805  [0805]
C30  33nF 50V  33NF-50V0805  [0805]
C31  33nF 50V  33NF-50V0805  [0805]
C32  33nF 50V  33NF-50V0805  [0805]
C36  33nF 50V  33NF-50V0805  [0805]
C37  33nF 50V  33NF-50V0805  [0805]
C38  33nF 50V  33NF-50V0805  [0805]
C39  33nF 50V  33NF-50V0805  [0805]
C40  33nF 50V  33NF-50V0805  [0805]
C41  33nF 50V  33NF-50V0805  [0805]
C42  33nF 50V  33NF-50V0805  [0805]
C43  33nF 50V  33NF-50V0805  [0805]
C44  33nF 50V  33NF-50V0805  [0805]
C48  33nF 50V  33NF-50V0805  [0805]
C49  33nF 50V  33NF-50V0805  [0805]
C50  33nF 50V  33NF-50V0805  [0805]
C54  33nF 50V  33NF-50V0805  [0805]
C55  33nF 50V  33NF-50V0805  [0805]
C56  33nF 50V  33NF-50V0805  [0805]
IC6  HLW8032  [SO8]
IC7  HLW8032  [SO8]
IC8  HLW8032  [SO8]
IC10  HLW8032  [SO8]
IC11  HLW8032  [SO8]
IC12  HLW8032  [SO8]
IC14  HLW8032  [SO8]
IC16  HLW8032  [SO8]
L_OUT1  MOUNT-PAD-ROUND2.8  [2,8-PAD]
L_OUT2  MOUNT-PAD-ROUND2.8  [2,8-PAD]
L_OUT3  MOUNT-PAD-ROUND2.8  [2,8-PAD]
L_OUT4  MOUNT-PAD-ROUND2.8  [2,8-PAD]
L_OUT5  MOUNT-PAD-ROUND2.8  [2,8-PAD]
L_OUT6  MOUNT-PAD-ROUND2.8  [2,8-PAD]
L_OUT7  MOUNT-PAD-ROUND2.8  [2,8-PAD]
L_OUT8  MOUNT-PAD-ROUND2.8  [2,8-PAD]
N_OUT1  MOUNT-PAD-ROUND2.8  [2,8-PAD]
N_OUT2  MOUNT-PAD-ROUND2.8  [2,8-PAD]
N_OUT3  MOUNT-PAD-ROUND2.8  [2,8-PAD]
N_OUT4  MOUNT-PAD-ROUND2.8  [2,8-PAD]
N_OUT5  MOUNT-PAD-ROUND2.8  [2,8-PAD]
N_OUT6  MOUNT-PAD-ROUND2.8  [2,8-PAD]
N_OUT7  MOUNT-PAD-ROUND2.8  [2,8-PAD]
N_OUT8  MOUNT-PAD-ROUND2.8  [2,8-PAD]
R25  0.002R 1%  0.002R-1%2512  [2512]
R26  0.002R 1%  0.002R-1%2512  [2512]
R27  0.002R 1%  0.002R-1%2512  [2512]
R28  0.002R 1%  0.002R-1%2512  [2512]
R29  0.002R 1%  0.002R-1%2512  [2512]
R30  0.002R 1%  0.002R-1%2512  [2512]
R31  0.002R 1%  0.002R-1%2512  [2512]
R32  0.002R 1%  0.002R-1%2512  [2512]
R33  1K 1%  1K-1%0805  [0805]
R34  1K 1%  1K-1%0805  [0805]
R35  0.002R 1%  0.002R-1%2512  [2512]
R36  470K 1%  470K-1%0805  [0805]
R37  470K 1%  470K-1%0805  [0805]
R38  470K 1%  470K-1%0805  [0805]
R39  470K 1%  470K-1%0805  [0805]
R40  1K 1%  1K-1%0805  [0805]
R41  1K 1%  1K-1%0805  [0805]
R42  1K 1%  1K-1%0805  [0805]
R43  0.002R 1%  0.002R-1%2512  [2512]
R44  470K 1%  470K-1%0805  [0805]
R45  470K 1%  470K-1%0805  [0805]
R46  470K 1%  470K-1%0805  [0805]
R47  470K 1%  470K-1%0805  [0805]
R48  1K 1%  1K-1%0805  [0805]
R49  1K 1%  1K-1%0805  [0805]
R50  1K 1%  1K-1%0805  [0805]
R51  0.002R 1%  0.002R-1%2512  [2512]
R52  470K 1%  470K-1%0805  [0805]
R53  470K 1%  470K-1%0805  [0805]
R54  470K 1%  470K-1%0805  [0805]
R55  470K 1%  470K-1%0805  [0805]
R56  1K 1%  1K-1%0805  [0805]
R65  1K 1%  1K-1%0805  [0805]
R66  1K 1%  1K-1%0805  [0805]
R67  0.002R 1%  0.002R-1%2512  [2512]
R68  470K 1%  470K-1%0805  [0805]
R69  470K 1%  470K-1%0805  [0805]
R70  470K 1%  470K-1%0805  [0805]
R71  470K 1%  470K-1%0805  [0805]
R72  1K 1%  1K-1%0805  [0805]
R73  1K 1%  1K-1%0805  [0805]
R74  1K 1%  1K-1%0805  [0805]
R75  0.002R 1%  0.002R-1%2512  [2512]
R76  470K 1%  470K-1%0805  [0805]
R77  470K 1%  470K-1%0805  [0805]
R78  470K 1%  470K-1%0805  [0805]
R79  470K 1%  470K-1%0805  [0805]
R80  1K 1%  1K-1%0805  [0805]
R81  1K 1%  1K-1%0805  [0805]
R82  1K 1%  1K-1%0805  [0805]
R83  0.002R 1%  0.002R-1%2512  [2512]
R84  470K 1%  470K-1%0805  [0805]
R85  470K 1%  470K-1%0805  [0805]
R86  470K 1%  470K-1%0805  [0805]
R87  470K 1%  470K-1%0805  [0805]
R88  1K 1%  1K-1%0805  [0805]
R97  1K 1%  1K-1%0805  [0805]
R98  1K 1%  1K-1%0805  [0805]
R99  0.002R 1%  0.002R-1%2512  [2512]
R100  470K 1%  470K-1%0805  [0805]
R101  470K 1%  470K-1%0805  [0805]
R102  470K 1%  470K-1%0805  [0805]
R103  470K 1%  470K-1%0805  [0805]
R104  1K 1%  1K-1%0805  [0805]
R113  1K 1%  1K-1%0805  [0805]
R114  1K 1%  1K-1%0805  [0805]
R115  0.002R 1%  0.002R-1%2512  [2512]
R116  470K 1%  470K-1%0805  [0805]
R117  470K 1%  470K-1%0805  [0805]
R118  470K 1%  470K-1%0805  [0805]
R119  470K 1%  470K-1%0805  [0805]
R120  1K 1%  1K-1%0805  [0805]

### Nets
+5V_MEA: IC6.1(VDD) IC7.1(VDD) IC8.1(VDD) IC10.1(VDD) IC11.1(VDD) IC12.1(VDD) IC14.1(VDD) IC16.1(VDD) ; also sheet 3,6
AGND: C24.2 C25.2 C26.2 C27.2 C28.2 C29.2 C30.2 C31.2 C32.2 C36.2 C37.2 C38.2 C39.2 C40.2 C41.2 C42.2 C43.2 C44.2 C48.2 C49.2 C50.2 C54.2 C55.2 C56.2 IC6.5(GND) IC7.5(GND) IC8.5(GND) IC10.5(GND) IC11.5(GND) IC12.5(GND) IC14.5(GND) IC16.5(GND) R25.2 R26.2 R27.2 R28.2 R29.2 R30.2 R31.2 R32.2 R33.1 R35.2 R40.2 R41.1 R43.2 R48.2 R49.1 R51.2 R56.2 R65.1 R67.2 R72.2 R73.1 R75.2 R80.2 R81.1 R83.2 R88.2 R97.1 R99.2 R104.2 R113.1 R115.2 R120.2 ; also sheet 3,6
N$12 [AC_MEA]: C24.1 IC6.2(INP) R33.2
N$22 [AC_MEA]: C25.1 IC6.3(INN) R34.2
N$27 [AC_MEA]: R38.2 R39.1
N$28 [AC_MEA]: R52.2 R53.2
N$29 [AC_MEA]: R37.1 R38.1
N$30 [AC_MEA]: C26.1 IC6.4(VP) R39.2 R40.1
N$31 [AC_MEA]: C27.1 IC7.2(INP) R41.2
N$32 [AC_MEA]: C28.1 IC7.3(INN) R42.2
N$33 [AC_MEA]: R53.1 R54.1
N$34 [AC_MEA]: R54.2 R55.1
N$35 [AC_MEA]: R68.2 R69.2
N$36 [AC_MEA]: C29.1 IC7.4(VP) R47.2 R48.1
N$47 [AC_MEA]: C30.1 IC8.2(INP) R49.2
N$48 [AC_MEA]: C31.1 IC8.3(INN) R50.2
N$49 [AC_MEA]: R69.1 R70.1
N$50 [AC_MEA]: R70.2 R71.1
N$51 [AC_MEA]: R84.2 R85.2
N$52 [AC_MEA]: C32.1 IC8.4(VP) R55.2 R56.1
N$59 [AC_MEA]: C36.1 IC10.2(INP) R65.2
N$60 [AC_MEA]: C37.1 IC10.3(INN) R66.2
N$61 [AC_MEA]: R85.1 R86.1
N$62 [AC_MEA]: R86.2 R87.1
N$63 [AC_MEA]: R44.2 R45.2
N$64 [AC_MEA]: C38.1 IC10.4(VP) R71.2 R72.1
N$65 [AC_MEA]: C39.1 IC11.2(INP) R73.2
N$66 [AC_MEA]: C40.1 IC11.3(INN) R74.2
N$67 [AC_MEA]: R45.1 R46.1
N$68 [AC_MEA]: R46.2 R47.1
N$69 [AC_MEA]: R76.2 R77.2
N$70 [AC_MEA]: C41.1 IC11.4(VP) R79.2 R80.1
N$71 [AC_MEA]: C42.1 IC12.2(INP) R81.2
N$72 [AC_MEA]: C43.1 IC12.3(INN) R82.2
N$73 [AC_MEA]: R77.1 R78.1
N$74 [AC_MEA]: R78.2 R79.1
N$75 [AC_MEA]: R100.2 R101.2
N$76 [AC_MEA]: C44.1 IC12.4(VP) R87.2 R88.1
N$83 [AC_MEA]: C48.1 IC14.2(INP) R97.2
N$84 [AC_MEA]: C49.1 IC14.3(INN) R98.2
N$85 [AC_MEA]: R101.1 R102.1
N$86 [AC_MEA]: R102.2 R103.1
N$87 [AC_MEA]: R116.2 R117.2
N$88 [AC_MEA]: C50.1 IC14.4(VP) R103.2 R104.1
N$95 [AC_MEA]: C54.1 IC16.2(INP) R113.2
N$96 [AC_MEA]: C55.1 IC16.3(INN) R114.2
N$97 [AC_MEA]: R117.1 R118.1
N$98 [AC_MEA]: R118.2 R119.1
N$100 [AC_MEA]: C56.1 IC16.4(VP) R119.2 R120.1
N$116 [AC_MEA]: R36.1 R37.2
N_OUT1: N_OUT1.B2,8(MOUNT) R25.1 R34.1 R35.1
N_OUT2: N_OUT2.B2,8(MOUNT) R32.1 R50.1 R51.1
N_OUT3: N_OUT3.B2,8(MOUNT) R31.1 R66.1 R67.1
N_OUT4: N_OUT4.B2,8(MOUNT) R30.1 R82.1 R83.1
N_OUT5: N_OUT5.B2,8(MOUNT) R26.1 R42.1 R43.1
N_OUT6: N_OUT6.B2,8(MOUNT) R27.1 R74.1 R75.1
N_OUT7: N_OUT7.B2,8(MOUNT) R28.1 R98.1 R99.1
N_OUT8: N_OUT8.B2,8(MOUNT) R29.1 R114.1 R115.1
OUT_1: L_OUT1.B2,8(MOUNT) R36.2 ; also sheet 5
OUT_2: L_OUT2.B2,8(MOUNT) R52.1 ; also sheet 5
OUT_3: L_OUT3.B2,8(MOUNT) R68.1 ; also sheet 5
OUT_4: L_OUT4.B2,8(MOUNT) R84.1 ; also sheet 5
OUT_5: L_OUT5.B2,8(MOUNT) R44.1 ; also sheet 5
OUT_6: L_OUT6.B2,8(MOUNT) R76.1 ; also sheet 5
OUT_7: L_OUT7.B2,8(MOUNT) R100.1 ; also sheet 5
OUT_8: L_OUT8.B2,8(MOUNT) R116.1 ; also sheet 5
TX_CH1: IC6.6(TX) ; also sheet 6
TX_CH2: IC8.6(TX) ; also sheet 6
TX_CH3: IC10.6(TX) ; also sheet 6
TX_CH4: IC12.6(TX) ; also sheet 6
TX_CH5: IC7.6(TX) ; also sheet 6
TX_CH6: IC11.6(TX) ; also sheet 6
TX_CH7: IC14.6(TX) ; also sheet 6
TX_CH8: IC16.6(TX) ; also sheet 6
Unconnected: IC6.7(PF) IC6.8(RX) IC7.7(PF) IC7.8(RX) IC8.7(PF) IC8.8(RX) IC10.7(PF) IC10.8(RX) IC11.7(PF) IC11.8(RX) IC12.7(PF) IC12.8(RX) IC14.7(PF) IC14.8(RX) IC16.7(PF) IC16.8(RX)

### Notes on the sheet
- AC CHANNEL MEASUREMENT
- TO AGND=AC_N
- 2x 0.002R=
  0.001R
- FROM DEVICE >
- TO DEVICE <
- RELAY OUT ^
- MAIN BOARD
- Rev 1.0.0
- David Sipos / DvidMakesThings

## Sheet 5 of 6: RELAYS
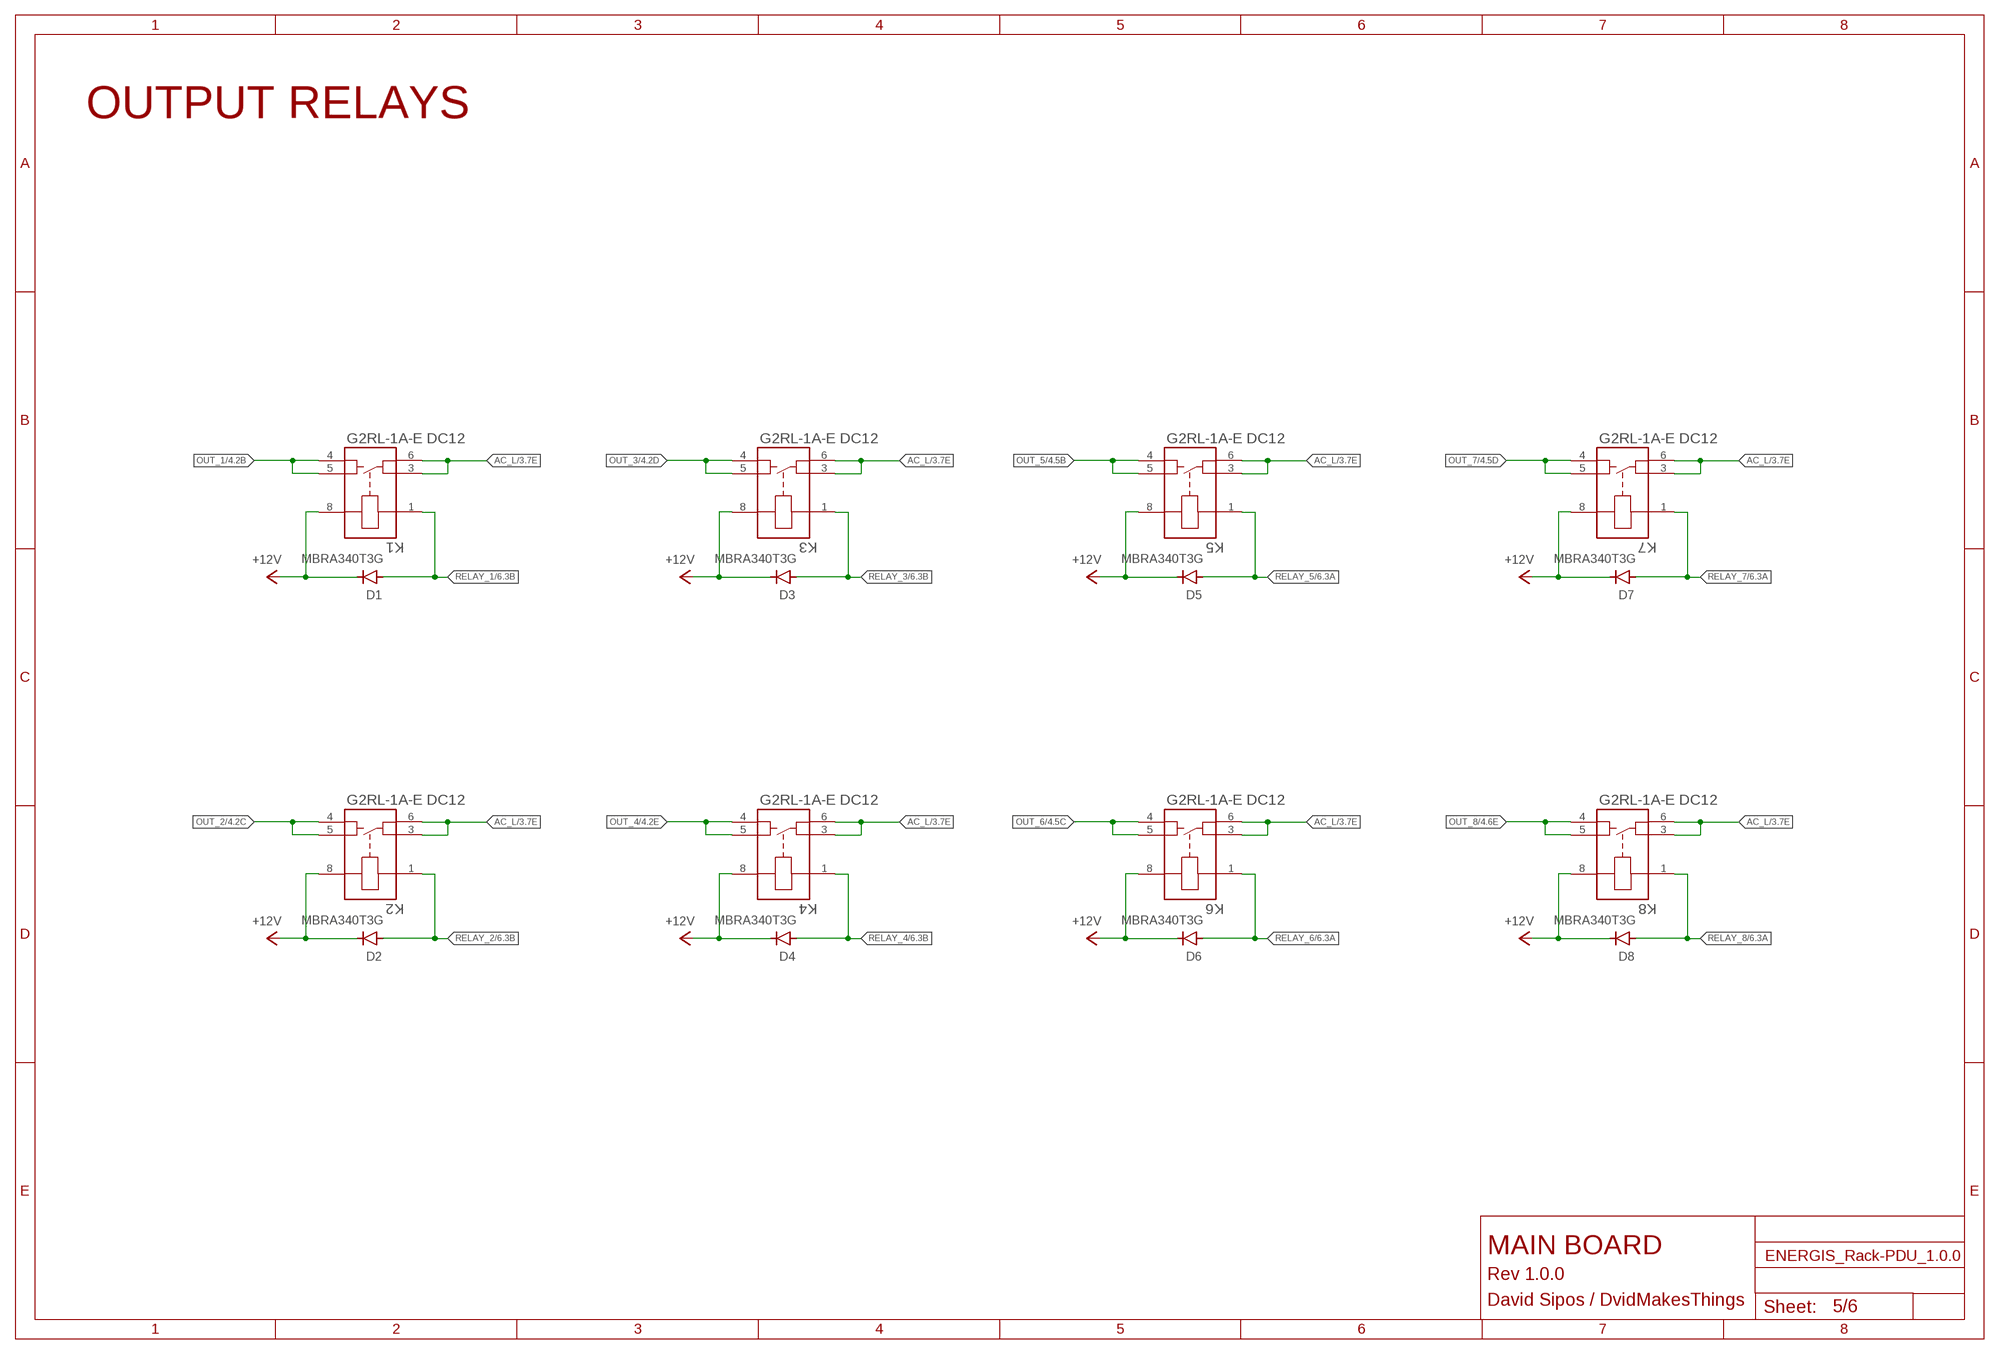
[diagram p4: schematic, sheet 5]

### Parts
D1  MBRA340T3G  [SMA/DO-214AC]
D2  MBRA340T3G  [SMA/DO-214AC]
D3  MBRA340T3G  [SMA/DO-214AC]
D4  MBRA340T3G  [SMA/DO-214AC]
D5  MBRA340T3G  [SMA/DO-214AC]
D6  MBRA340T3G  [SMA/DO-214AC]
D7  MBRA340T3G  [SMA/DO-214AC]
D8  MBRA340T3G  [SMA/DO-214AC]
K1  G2RL-1A-E DC12  G2RL-1A-E_DC12  [RELAY_G2RL-1A-E_DC5_OMR]
K2  G2RL-1A-E DC12  G2RL-1A-E_DC12  [RELAY_G2RL-1A-E_DC5_OMR]
K3  G2RL-1A-E DC12  G2RL-1A-E_DC12  [RELAY_G2RL-1A-E_DC5_OMR]
K4  G2RL-1A-E DC12  G2RL-1A-E_DC12  [RELAY_G2RL-1A-E_DC5_OMR]
K5  G2RL-1A-E DC12  G2RL-1A-E_DC12  [RELAY_G2RL-1A-E_DC5_OMR]
K6  G2RL-1A-E DC12  G2RL-1A-E_DC12  [RELAY_G2RL-1A-E_DC5_OMR]
K7  G2RL-1A-E DC12  G2RL-1A-E_DC12  [RELAY_G2RL-1A-E_DC5_OMR]
K8  G2RL-1A-E DC12  G2RL-1A-E_DC12  [RELAY_G2RL-1A-E_DC5_OMR]

### Nets
+12V: D1.C D2.C D3.C D4.C D5.C D6.C D7.C D8.C K1.8 K2.8 K3.8 K4.8 K5.8 K6.8 K7.8 K8.8 ; also sheet 3,6
AC_L: K1.3 K1.6 K2.3 K2.6 K3.3 K3.6 K4.3 K4.6 K5.3 K5.6 K6.3 K6.6 K7.3 K7.6 K8.3 K8.6 ; also sheet 3
OUT_1: K1.4 K1.5 ; also sheet 4
OUT_2: K2.4 K2.5 ; also sheet 4
OUT_3: K3.4 K3.5 ; also sheet 4
OUT_4: K4.4 K4.5 ; also sheet 4
OUT_5: K5.4 K5.5 ; also sheet 4
OUT_6: K6.4 K6.5 ; also sheet 4
OUT_7: K7.4 K7.5 ; also sheet 4
OUT_8: K8.4 K8.5 ; also sheet 4
RELAY_1: D1.A K1.1 ; also sheet 6
RELAY_2: D2.A K2.1 ; also sheet 6
RELAY_3: D3.A K3.1 ; also sheet 6
RELAY_4: D4.A K4.1 ; also sheet 6
RELAY_5: D5.A K5.1 ; also sheet 6
RELAY_6: D6.A K6.1 ; also sheet 6
RELAY_7: D7.A K7.1 ; also sheet 6
RELAY_8: D8.A K8.1 ; also sheet 6

### Notes on the sheet
- OUTPUT RELAYS
- MAIN BOARD
- Rev 1.0.0
- David Sipos / DvidMakesThings

## Sheet 6 of 6: DRIVERS AND PERIPHERALS
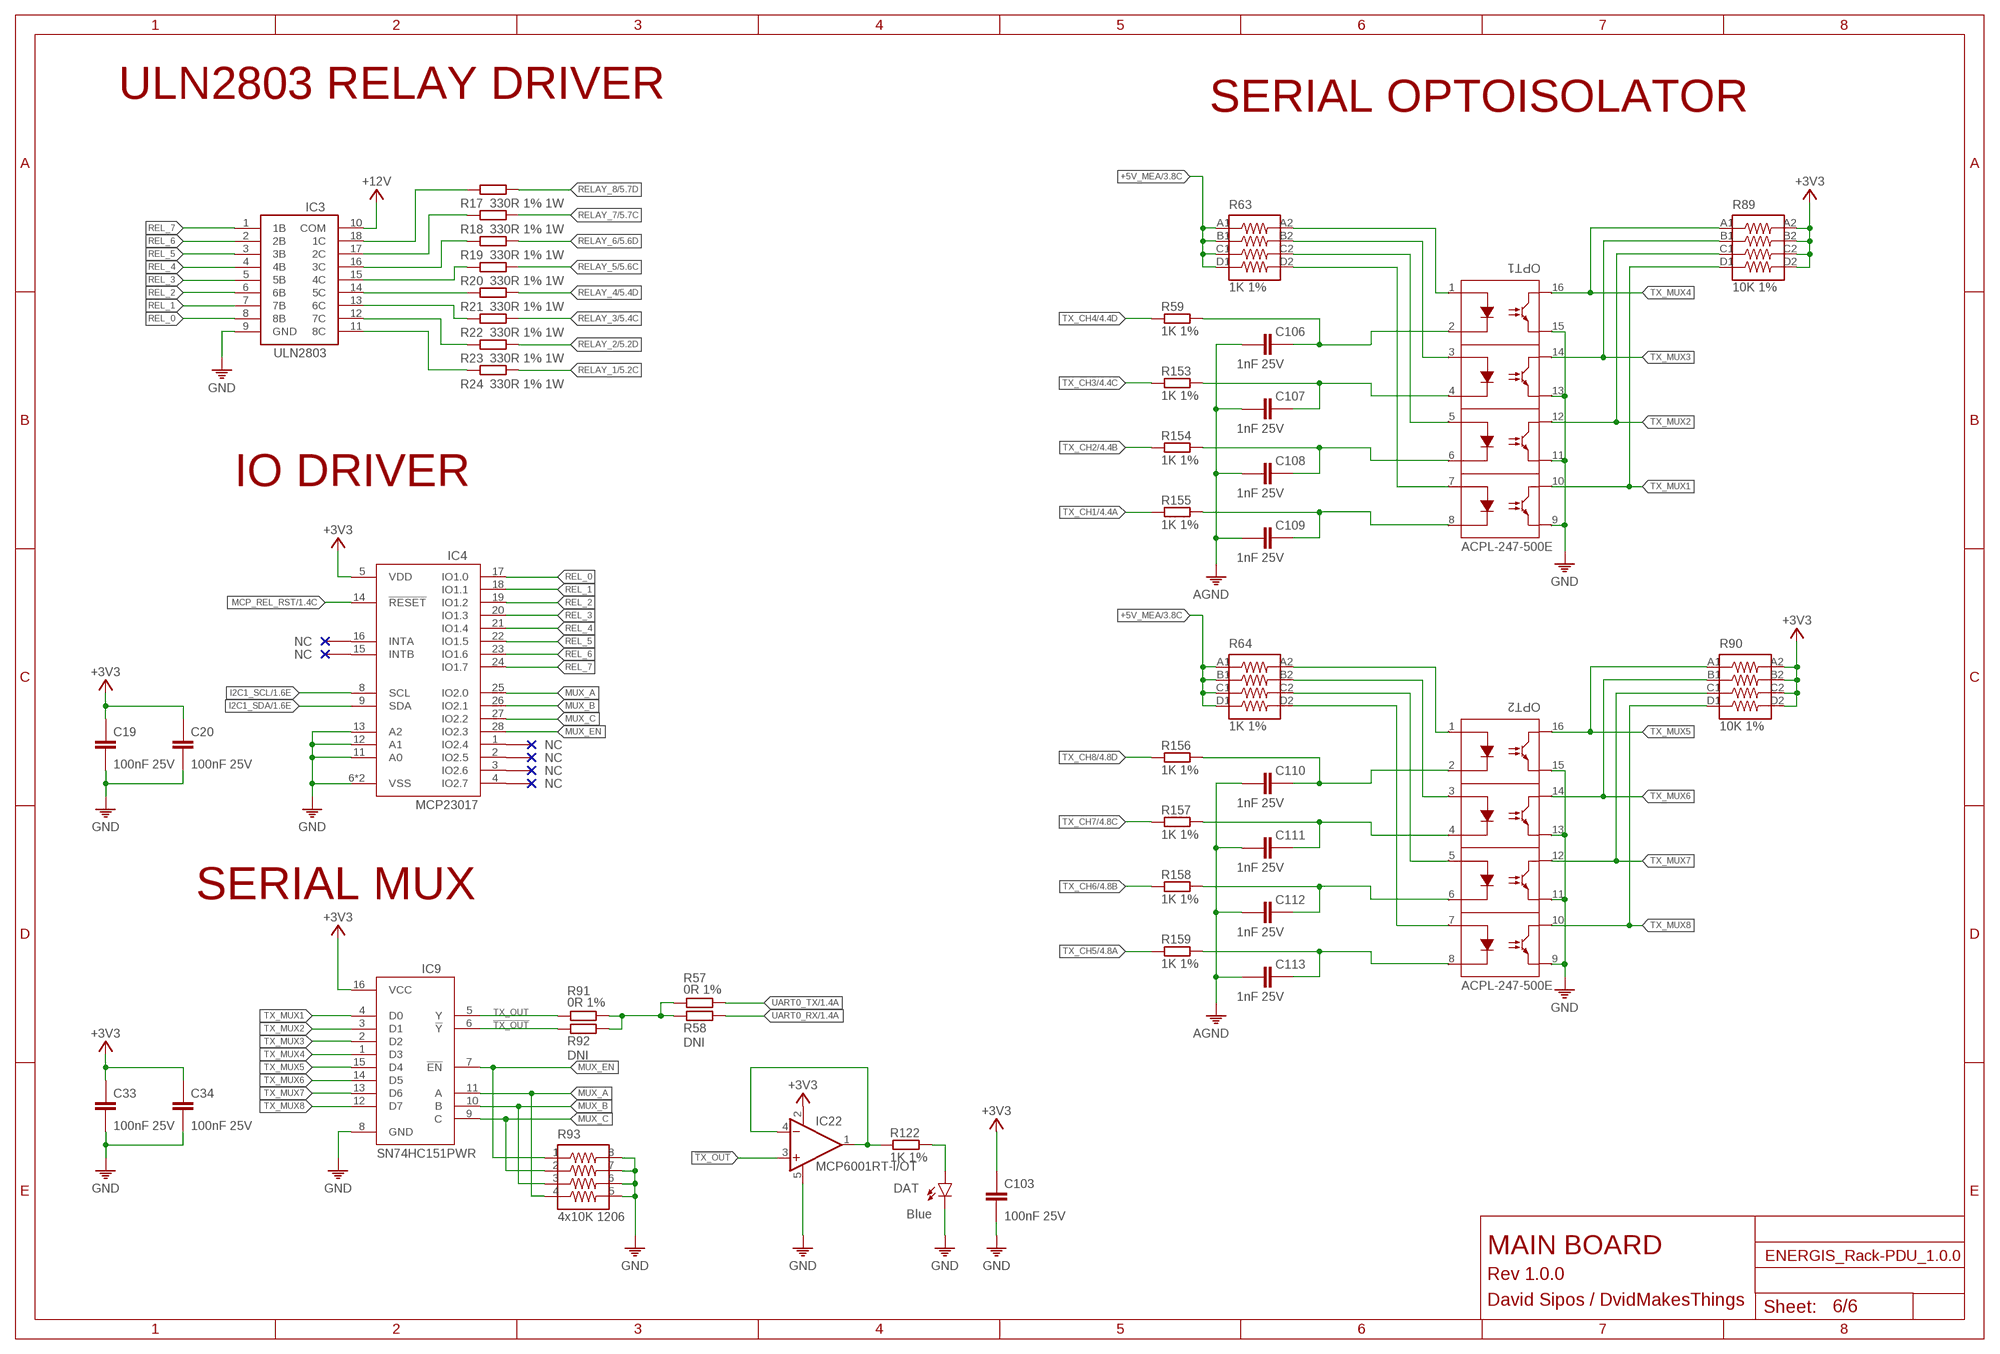
[diagram p5: schematic, sheet 6]

### Parts
C19  100nF 25V  100NF-25V-0402  [0402]
C20  100nF 25V  100NF-25V-0402  [0402]
C33  100nF 25V  100NF-25V-0402  [0402]
C34  100nF 25V  100NF-25V-0402  [0402]
C103  100nF 25V  100NF-25V-0201  [0201]
C106  1nF 25V  1NF-25V-0201  [0201]
C107  1nF 25V  1NF-25V-0201  [0201]
C108  1nF 25V  1NF-25V-0201  [0201]
C109  1nF 25V  1NF-25V-0201  [0201]
C110  1nF 25V  1NF-25V-0201  [0201]
C111  1nF 25V  1NF-25V-0201  [0201]
C112  1nF 25V  1NF-25V-0201  [0201]
C113  1nF 25V  1NF-25V-0201  [0201]
DAT  Blue  LED-BLUELED-0603  [LED-0603]
IC3  ULN2803AFWG  ULN2803  [SO18]
IC4  MCP23017T-E/ML  MCP23017-E/ML  [QFN28[6X6]ML]
IC9  SN74HC151PWR  [TSSOP16]
IC22  MCP6001RT-I/OT  MCP6001RT  [SOT23-5]
OPT1  ACPL-247-500E  ACPL-2471  [SO16]
OPT2  ACPL-247-500E  ACPL-2471  [SO16]
R17  330R 1% 1W  330R-1%-2512  [2512]
R18  330R 1% 1W  330R-1%-2512  [2512]
R19  330R 1% 1W  330R-1%-2512  [2512]
R20  330R 1% 1W  330R-1%-2512  [2512]
R21  330R 1% 1W  330R-1%-2512  [2512]
R22  330R 1% 1W  330R-1%-2512  [2512]
R23  330R 1% 1W  330R-1%-2512  [2512]
R24  330R 1% 1W  330R-1%-2512  [2512]
R57  0R 1%  0R0402  [0402]
R58  DNI  R0402  [0402]
R59  1K 1%  1K-1%0201  [0201]
R63  1K 1%  1K-1%_ARRAY0603X4-1206  [_0603X4-1206]
R64  1K 1%  1K-1%_ARRAY0603X4-1206  [_0603X4-1206]
R89  10K 1%  10K-1%_ARRAY0603X4-1206  [_0603X4-1206]
R90  10K 1%  10K-1%_ARRAY0603X4-1206  [_0603X4-1206]
R91  0R 1%  0R0402  [0402]
R92  DNI  R0402  [0402]
R93  4x10K 1206  742C083103JP  [742C083103JP]
R122  1K 1%  1K-1%0402  [0402]
R153  1K 1%  1K-1%0201  [0201]
R154  1K 1%  1K-1%0201  [0201]
R155  1K 1%  1K-1%0201  [0201]
R156  1K 1%  1K-1%0201  [0201]
R157  1K 1%  1K-1%0201  [0201]
R158  1K 1%  1K-1%0201  [0201]
R159  1K 1%  1K-1%0201  [0201]

### Nets
!TX_OUT: IC9.6(!Y) IC22.3(+IN) R92.1
+3V3: C19.1 C20.1 C33.1 C34.1 C103.1 IC4.5(VDD) IC9.16(VCC) IC22.2(V+) R89.A2 R89.B2 R89.C2 R89.D2 R90.A2 R90.B2 R90.C2 R90.D2 ; also sheet 2,3
+5V_MEA: R63.A1 R63.B1 R63.C1 R63.D1 R64.A1 R64.B1 R64.C1 R64.D1 ; also sheet 3,4
+12V: IC3.10(COM) ; also sheet 3,5
AGND: C106.2 C107.2 C108.2 C109.2 C110.2 C111.2 C112.2 C113.2 ; also sheet 3,4
GND: C19.2 C20.2 C33.2 C34.2 C103.2 DAT.C IC3.9(GND) IC4.6(VSS) IC4.11(A0) IC4.12(A1) IC4.13(A2) IC4.PAD(VSS) IC9.8(GND) IC22.5(V-) OPT1.9 OPT1.11 OPT1.13 OPT1.15 OPT2.9 OPT2.11 OPT2.13 OPT2.15 R93.5 R93.6 R93.7 R93.8 ; also sheet 1,2,3
I2C1_SCL: IC4.8(SCL) ; also sheet 1
I2C1_SDA: IC4.9(SDA) ; also sheet 1
MCP_REL_RST: IC4.14(!RESET) ; also sheet 1
MUX_A: IC4.25(IO2.0) IC9.11(A) R93.4
MUX_B: IC4.26(IO2.1) IC9.10(B) R93.3
MUX_C: IC4.27(IO2.2) IC9.9(C) R93.2
MUX_EN: IC4.28(IO2.3) IC9.7(!EN) R93.1
N$1: DAT.A R122.2
N$4: IC3.14(5C) R21.1
N$6: IC3.11(8C) R24.1
N$7: IC3.12(7C) R23.1
N$8: IC3.13(6C) R22.1
N$10: IC3.15(4C) R20.1
N$11: IC3.16(3C) R19.1
N$13: IC3.17(2C) R18.1
N$15: IC3.18(1C) R17.1
REL_0: IC3.8(8B) IC4.17(IO1.0)
REL_1: IC3.7(7B) IC4.18(IO1.1)
REL_2: IC3.6(6B) IC4.19(IO1.2)
REL_3: IC3.5(5B) IC4.20(IO1.3)
REL_4: IC3.4(4B) IC4.21(IO1.4)
REL_5: IC3.3(3B) IC4.22(IO1.5)
REL_6: IC3.2(2B) IC4.23(IO1.6)
REL_7: IC3.1(1B) IC4.24(IO1.7)
RELAY_1: R24.2 ; also sheet 5
RELAY_2: R23.2 ; also sheet 5
RELAY_3: R22.2 ; also sheet 5
RELAY_4: R21.2 ; also sheet 5
RELAY_5: R20.2 ; also sheet 5
RELAY_6: R19.2 ; also sheet 5
RELAY_7: R18.2 ; also sheet 5
RELAY_8: R17.2 ; also sheet 5
TX1_LP: C109.1 OPT1.8 R155.2
TX1_PU: OPT1.7 R63.D2
TX2_LP: C108.1 OPT1.6 R154.2
TX2_PU: OPT1.5 R63.C2
TX3_LP: C107.1 OPT1.4 R153.2
TX3_PU: OPT1.3 R63.B2
TX4_LP: C106.1 OPT1.2 R59.2
TX4_PU: OPT1.1 R63.A2
TX5_LP: C110.1 OPT2.2 R156.2
TX5_PU: OPT2.1 R64.A2
TX6_LP: C111.1 OPT2.4 R157.2
TX6_PU: OPT2.3 R64.B2
TX7_LP: C112.1 OPT2.6 R158.2
TX7_PU: OPT2.5 R64.C2
TX8_LP: C113.1 OPT2.8 R159.2
TX8_PU: OPT2.7 R64.D2
TX_CH1: R155.1 ; also sheet 4
TX_CH2: R154.1 ; also sheet 4
TX_CH3: R153.1 ; also sheet 4
TX_CH4: R59.1 ; also sheet 4
TX_CH5: R159.1 ; also sheet 4
TX_CH6: R158.1 ; also sheet 4
TX_CH7: R157.1 ; also sheet 4
TX_CH8: R156.1 ; also sheet 4
TX_FB: IC22.1(OUT) IC22.4(-IN) R122.1
TX_MUX1: IC9.4(D0) OPT1.10 R89.D1
TX_MUX2: IC9.3(D1) OPT1.12 R89.C1
TX_MUX3: IC9.2(D2) OPT1.14 R89.B1
TX_MUX4: IC9.1(D3) OPT1.16 R89.A1
TX_MUX5: IC9.15(D4) OPT2.16 R90.A1
TX_MUX6: IC9.14(D5) OPT2.14 R90.B1
TX_MUX7: IC9.13(D6) OPT2.12 R90.C1
TX_MUX8: IC9.12(D7) OPT2.10 R90.D1
TX_OUT: IC9.5(Y) R91.1
TX_OUTSEL: R57.1 R58.1 R91.2 R92.2
UART0_RX: R58.2 ; also sheet 1
UART0_TX: R57.2 ; also sheet 1
Unconnected: IC4.1(IO2.4) IC4.2(IO2.5) IC4.3(IO2.6) IC4.4(IO2.7) IC4.15(INTB) IC4.16(INTA)

### Notes on the sheet
- ULN2803 RELAY DRIVER | SERIAL OPTOISOLATOR
- IO DRIVER
- SERIAL MUX
- MAIN BOARD
- Rev 1.0.0
- David Sipos / DvidMakesThings

## Library data of the parts
3VDC 3VFB 5V-NI1 5V-NI2 5VDC 5VFB 12VDC AVDD DVDD FB-NI1 FB-NI2 GND GND-3 GND-5 IOVDD L-REC1 L-REC2 SW SW3 VBUS VNI1 VNI2 VREF = ds_passive:TP
AC/DC1 = ds_trafo:IRM_10_12: 10W AC-DC PCB-Mount Green Power Module; DATASHEET: https://www.meanwell.com/Upload/PDF/IRM-10/IRM-10-SPEC.PDF; DESCRIPTION: - Power supply module,Power Supplies ROHS; LCSC_PART: C20618065
AC/DC2 = ds_trafo:IRM_10_12: 10W AC-DC PCB-Mount Green Power Module; DATASHEET: https://www.meanwell.com/Upload/PDF/IRM-15/IRM-15-SPEC.PDF; DESCRIPTION: 15W AC-DC PCB-Mount Green Power Module; LCSC_PART: C5439799
AC_L AC_N L_OUT1-L_OUT8 N_OUT1-N_OUT8 = holes:MOUNT-PAD-ROUND: MOUNTING PAD, round
BOOT RESET = ds_passive:B3U-1000P: 2.5mm 1.6mm Round Button 50mA Standing paste 3mm SPST 153gf 12V SMD,2.5x3mm Tactile Switches ROHS; DATASHEET: https://omronfs.omron.com/en_US/ecb/products/pdf/en-b3u.pdf; DESCRIPTION: 2.5mm 1.6mm Round Button 50mA Standing paste 3mm SPST 153gf 12V SMD,2.5x3mm Tactile Switches ROHS; LCSC_PART: C231329
C1 C2 C14 C15 C17 C18 = ds_capacitors:22UF-25V; DESCRIPTION: 25V 22uF X5R ±10% 1206 Multilayer Ceramic Capacitors MLCC - SMD/SMT ROHS; LCSC_PART: C12891
C3 C4 C6-C9 C19 C20 C33 C34 C66 C79 = ds_capacitors:100NF-25V; DESCRIPTION: 25V 100nF X7R ±10% 0402 Multilayer Ceramic Capacitors MLCC - SMD/SMT ROHS; LCSC_PART: C56392
C5 C51 = ds_capacitors:1NF-50V; DESCRIPTION: 50V 1nF X7R ±10% 0603 Multilayer Ceramic Capacitors MLCC - SMD/SMT ROHS; LCSC_PART: C1588
C10 C13 C16 = ds_capacitors:100UF-25V; DESCRIPTION: 100uF 25V 90mA@120Hz ±20% SMD,D6.3xL7.7mm Aluminum Electrolytic Capacitors - SMD ROHS; LCSC_PART: C267469
C11 C12 = ds_capacitors:33PF-50V; DESCRIPTION: 50V 33pF NP0 ±5% 0402 Multilayer Ceramic Capacitors MLCC - SMD/SMT ROHS; LCSC_PART: C107005
C21 C46 = ds_capacitors:2.2UF-50V; DESCRIPTION: 50V 2.2uF X5R ±10% 0603 Multilayer Ceramic Capacitors MLCC - SMD/SMT ROHS; LCSC_PART: C913904
C22 C52 = ds_capacitors:220NF-50V; DESCRIPTION: 50V 220nF X7R ±10% 0805 Multilayer Ceramic Capacitors MLCC - SMD/SMT ROHS; LCSC_PART: C5378
C23 C53 = ds_capacitors:100UF-50V; DESCRIPTION: 100uF 50V 229mA@120Hz ±20% SMD,D6.3xL7.7mm Aluminum Electrolytic Capacitors - SMD ROHS; LCSC_PART: C3151829
C24-C32 C36-C44 C48-C50 C54-C56 = ds_capacitors:33NF-50V; DESCRIPTION: 50V 33nF X7R ±10% 0805 Multilayer Ceramic Capacitors MLCC - SMD/SMT ROHS; LCSC_PART: C107150
C35 C47 = ds_capacitors:2.2UF-400V; DESCRIPTION: 2.2uF 400V 28mA@120Hz ±20% SMD,D6.3xL10mm Aluminum Electrolytic Capacitors - SMD ROHS; LCSC_PART: C3345109
C45 C57 = ds_capacitors:1UF-50V; DESCRIPTION: 50V 1uF X7R ±10% 0805 Multilayer Ceramic Capacitors MLCC - SMD/SMT ROHS; LCSC_PART: C28323
C58 C59 = ds_capacitors:15PF-50V; DESCRIPTION: 50V 15pF C0G ±5% 0201 Multilayer Ceramic Capacitors MLCC - SMD/SMT ROHS; LCSC_PART: C22374851
C60 C104 = ds_capacitors:1UF-25V; DESCRIPTION: 25V 1uF X5R ±10% 0402 Multilayer Ceramic Capacitors MLCC - SMD/SMT ROHS; LCSC_PART: C52923
C61-C64 C67-C77 C84 C88-C96 C98 C100 C101 C103 = ds_capacitors:100NF-25V; DESCRIPTION: 25V 100nF X5R ±10% 0201 Multilayer Ceramic Capacitors MLCC - SMD/SMT ROHS; LCSC_PART: C76939
C65 C97 C99 = ds_capacitors:10UF-50V; DESCRIPTION: 50V 10uF X5R ±10% 0805 Multilayer Ceramic Capacitors MLCC - SMD/SMT ROHS; LCSC_PART: C440198
C78 = ds_capacitors:4.7NF-50V; DESCRIPTION: 50V 4.7nF X7R ±10% 0402 Multilayer Ceramic Capacitors MLCC - SMD/SMT ROHS; LCSC_PART: C1538
C80 = ds_capacitors:22NF-50V; DESCRIPTION: 50V 22nF X7R ±10% 0402 Multilayer Ceramic Capacitors MLCC - SMD/SMT ROHS; LCSC_PART: C1532
C81 C82 = ds_capacitors:6.8NF-50V; DESCRIPTION: 50V 6.8nF X7R ±10% 0201 Multilayer Ceramic Capacitors MLCC - SMD/SMT ROHS; LCSC_PART: C285015
C83 = ds_passive:C
C85 = ds_capacitors:4.7UF-25V; DESCRIPTION: 25V 4.7uF X5R ±20% 0402 Multilayer Ceramic Capacitors MLCC - SMD/SMT ROHS; LCSC_PART: C22367824
C86 C87 = ds_capacitors:18PF-50V; DESCRIPTION: 50V 18pF C0G ±5% 0201 Multilayer Ceramic Capacitors MLCC - SMD/SMT ROHS; LCSC_PART: C62164
C102 = ds_capacitors:1UF-16V; DESCRIPTION: 16V 1uF X5R ±20% 0201 Multilayer Ceramic Capacitors MLCC - SMD/SMT ROHS; LCSC_PART: C307385
C106-C113 = ds_capacitors:1NF-25V; DESCRIPTION: 25V 1nF X7R ±10% 0201 Multilayer Ceramic Capacitors MLCC - SMD/SMT ROHS; LCSC_PART: C7694325V
D1-D8 = ds_diode:MBRA340T3G: 40V 450mV@3A 3A SMA(DO-214AC) Schottky Diodes ROHS; DATASHEET: https://www.onsemi.com/download/data-sheet/pdf/mbra340t3-d.pdf; DESCRIPTION: 40V 450mV@3A 3A SMA(DO-214AC) Schottky Diodes ROHS; LCSC_PART: C26178
D9 D10 D12 D13 = ds_diode:1N4007: 1A Independent Type 1kV 1.1V@1A SMA(DO-214AC) Diodes - General Purpose ROHS; DATASHEET: https://www.sycelectronica.com.ar/semiconductores/1N4007-SMD.pdf?srsltid=AfmBOorCHiPwFTsNfQbBfqAoh5UjZ4nVNdjXugiEGIgvQSRi56Ew2-9Q; DESCRIPTION: 1A Independent Type 1kV 1.1V@1A SMA(DO-214AC) Diodes - General Purpose ROHS; LCSC_PART: C727081
D11 D14 = ds_diode:US1J: 1.7V@1A 1A 600V SMA(DO-214AC) Fast Recovery / High Efficiency Diodes ROHS; DATASHEET: https://www.vishay.com/docs/88768/us1_test_dcicons.pdf; DESCRIPTION: 1.7V@1A 1A 600V SMA(DO-214AC) Fast Recovery / High Efficiency Diodes ROHS; LCSC_PART: C44763
D15 = ds_diode:SS12: 20V Independent Type 450mV@1A 1A SMA(DO-214AC) Schottky Diodes ROHS; DATASHEET: https://www.vishay.com/docs/88746/ss12.pdf; DESCRIPTION: 20V Independent Type 450mV@1A 1A SMA(DO-214AC) Schottky Diodes ROHS; LCSC_PART: C727049
D16 = ds_diode:SMAJ15A: 16.4A 24.4V 16.7V 15V SMA(DO-214AC) ESD and Surge Protection (TVS/ESD) ROHS; DATASHEET: https://www.littelfuse.com/assetdocs/littelfuse_tvs_diode_smbj_datasheet.pdf?assetguid=09a6ae9a-73cb-4ac4-acac-e6dab92ab953; DESCRIPTION: 16.4A 24.4V 16.7V 15V SMA(DO-214AC) ESD and Surge Protection (TVS/ESD) ROHS; LCSC_PART: C23424
DAT = ds_LED:LED-BLUE; DESCRIPTION: 20mA 240mcd Colorless and transparent -20℃~+85℃ Positive Stick 455nm~475nm Blue 120° 70mW 3.3V 0603 LED Indication - Discrete ROHS; LCSC_PART: C965807
DSP = ds_con:AFC11-S20ICC-00: Drawer Type 20P Single-sided contact points/Vertical Standing paste 0.5mm SMD,P=0.5mm FFC, FPC (Flat Flexible) Connector Assemblies ROHS; DESCRIPTION: Drawer Type 20P Single-sided contact points/Vertical Standing paste 0.5mm SMD,P=0.5mm FFC, FPC (Flat Flexible) Connector Assemblies ROHS; LCSC_PART: C11073
ESD1 = ds_ic_peripherals:SP0503BAHT: TVS Diode Arrays Surface Mount TVS Avalanche Diode Array; DESCRIPTION: SOT-143 ESD and Surge Protection (TVS/ESD) ROHS; LCSC_PART: C3040626
ETH1 = ds_con:J1B1211CCD: RJ45Receptacle 1 Shielded Bend insert cat5 Gold Phosphor Bronze WithLED -40℃~+85℃ Plugin Ethernet Connectors / Modular Connectors (RJ45 RJ11) ROHS; DATASHEET: file:///C:/Users/sdvid/Downloads/j1b1211ccd.pdf; DESCRIPTION: RJ45Receptacle 1 Shielded Bend insert cat5 Gold Phosphor Bronze WithLED -40℃~+85℃ Plugin Ethernet Connectors / Modular Connectors (RJ45 RJ11) ROHS; LCSC_PART: C910371
GDGC RGTG = ds_con:CON-1X4
IC1 IC2 = ds_ic_vreg:MP2315: Description The MP2315 is a high frequency synchronous rectified step-down switch mode converter with built in internal power MOSFETs. It offers a very compact solution to achieve 3A continuous output current over a wide input supply range with excellent load and line regulation. The MP2315 has synchronous mode operation for higher efficiency over output current load range. Current mode operation provides fast transient response and eases loop stabilization. Full protection features include OCP and thermal shut down.; DATASHEET: https://www.monolithicpower.com/en/documentview/productdocument/index/version/2/document_type/Datasheet/lang/EN/sku/MP2315S?srsltid=AfmBOoqbTpEIx6KSoiWl4ZUQnKkVQGj573Ur79inB-ZmXjzR-CZxOYOr; DESCRIPTION: Step-down type Adjustable 800mV~22.8V 3A 4.5V~24V TSOT-23-8 DC-DC Converters ROHS; LCSC_PART: C45889
IC3 = ds_ic_peripherals:ULN2803: ULN2803A Darlington Transistor Arrays; DATASHEET: https://www.sycelectronica.com.ar/semiconductores/ULN2803-SMD.pdf?srsltid=AfmBOophiuKj-Ssp-X9zHCj-smbNohAULqg7ZzMWt7RSG8XB10-82Tty; DESCRIPTION: SOP-18-300mil Darlington Transistor Arrays ROHS; LCSC_PART: C845537
IC4 = ds_ic_peripherals:MCP23017: 16-Bit I2C I/O Expander with Serial Interface; DATASHEET: https://ww1.microchip.com/downloads/en/devicedoc/20001952c.pdf; DESCRIPTION: 1.7MHz I2C QFN-28-EP(6x6) I/O Expanders ROHS; LCSC_PART: C629439
IC5 IC13 = ds_ic_vreg:MP150: Offline Primary-Side Regulator For Low Power Applications; MP150: MP150GJ
IC6-IC8 IC10-IC12 IC14 IC16 = ds_ic_peripherals:HLW8032: Single-phase metering IC; DATASHEET: https://w2.electrodragon.com/Chip-cn-dat/HLW-dat/HLW8032-dat/HLW8032.pdf; DESCRIPTION: SOP-8 Energy Metering ROHS; LCSC_PART: C128023
IC9 = ds_ic_logic:SN74HC151PWR: 8-Line To 1-Line Data Selectors/Multiplexers; DATASHEET: https://www.ti.com/lit/ds/symlink/sn74hc151.pdf?ts=1749408396579&ref_url=https%253A%252F%252Fwww.google.com%252F; DESCRIPTION: 7.8mA 2V~6V 7.8mA TSSOP-16 Signal Switches, Multiplexers, Decoders ROHS; LCSC_PART: C2653837
IC15 = ds_ic_mcu:RP2040; DESCRIPTION: 133MHz LQFN-56(7x7) Microcontrollers (MCU/MPU/SOC) ROHS; LCSC_PART: C2040
IC17 IC22 = ds_ic_opa:MCP6001RT: 1 MHz, Low-Power Op Amp; DESCRIPTION: Single 1pA 0.6V/us 1MHz SOT-23-5 Operational Amplifier ROHS; LCSC_PART: C154973
IC18 = ds_ic_memory:W25Q128JV: 3V 128M-BIT SERIAL FLASH MEMORY WITH DUAL/QUAD SPI & QPI & DTR; DATASHEET: https://www.nikom.biz/pdf/A089014.pdf?srsltid=AfmBOopZgx1G_qpdWEIfoO5Ne0YuvaGR9ub92ZA1x90R1kz9P6rrUXmf; DESCRIPTION: 128Mbit WSON-8-EP(5x6) NOR FLASH ROHS; LCSC_PART: C190862
IC19 = ds_ic_memory:CAT24C256: The CAT24C256 is a EEPROM Serial 256−Kb I2C, internally organized as 32,768 words of 8 bits each. It features a 64−byte page write buffer and supports the Standard (100 kHz), Fast (400 kHz) and Fast−Plus (1 MHz) I2C protocol. Write operations can be inhibited by taking the WP pin High (this protects the entire memory). External address pins make it possible to address up to eight CAT24C256 devices on the same bus. On−Chip ECC (Error Correction Code) makes the device suitable for high reliability applications.; DATASHEET: https://www.onsemi.com/download/data-sheet/pdf/cat24c256-d.pdf; DESCRIPTION: 256Kbit I2C UDFN-8(2x3) EEPROM ROHS; LCSC_PART: C233771
IC20 = ds_ic_peripherals:W5500: The W5500 chip is a Hardwired TCP/IP embedded Ethernet controller that provides easier Internet connection to embedded systems. W5500 enables users to have the Internet connectivity in their applications just by using the single chip in which TCP/IP stack, 10/100 Ethernet MAC and PHY embedded. WIZnet‘s Hardwired TCP/IP is the market-proven technology that supports TCP, UDP, IPv4, ICMP, ARP, IGMP, and PPPoE protocols. W5500 embeds the 32Kbyte internal memory buffer for the Ethernet packet processing. If you use W5500, you can implement the Ethernet application just by adding the simple socket program. It’s faster and easier way rather than using any other Embedded Ethernet solution. Users can use 8 independent hardware sockets simultaneously. SPI (Serial Peripheral Interface) is provided for easy integration with the external MCU. The W5500’s SPI supports 80 MHz speed and new efficient SPI protocol for the high speed network communication. In order to reduce power consumption of the system, W5500 provides WOL (Wake on LAN) and power down mode.; DATASHEET: https://docs.wiznet.io/img/products/w5500/W5500_ds_v110e.pdf; DESCRIPTION: Ethernet Controllers ROHS; LCSC_PART: C32843
IC21 = ds_ic_vreg:MIC5504-3.3YM5-TR: The MIC5501/2/3/4 is an advanced general-purpose LDO ideal for powering general-purpose portable devices. The MIC5501/2/3/4 family of products provides a high-performance 300mA LDO; DATASHEET: https://ww1.microchip.com/downloads/en/DeviceDoc/MIC5501-02-03-04-300mA-Single-Output-LDO-in-Small-Packages-DS20006006B.pdf; DESCRIPTION: SOT-23-5 Voltage Regulators - Linear, Low Drop Out (LDO) Regulators ROHS; LCSC_PART: C41348078
J2 J7 = jumper:SJ: SMD solder JUMPER
J8-J10 = ds_resistor:0R; DESCRIPTION: 125mW Thick Film Resistors 150V ±800ppm/℃ ±1% 0Ω 0805 Chip Resistor - Surface Mount ROHS; LCSC_PART: C17477
K1-K8 = ds_passive:G2RL-1A-E_DC12: 12V 16A One Normally Open: 1A (SPST-NO) DIP,12.5x28.8mm Power Relays ROHS; DESCRIPTION: 12V 16A One Normally Open: 1A (SPST-NO) DIP,12.5x28.8mm Power Relays ROHS; LCSC_PART: C1564126
L1 L2 = ds_passive:L
L3 L5 = ds_inductor:1MH; DESCRIPTION: 260mA 1mH ±20% 220mA SMD,6x6mm Power Inductors ROHS; LCSC_PART: C168049
L4 = ds_inductor:BLM18EG221TN1D: 150mΩ ±25% 220Ω@100MHz 0603 Ferrite Beads ROHS; DESCRIPTION: 150mΩ ±25% 220Ω@100MHz 0603 Ferrite Beads ROHS; LCSC_PART: C113025
OPT1 OPT2 = ds_ic_peripherals:ACPL-247: DC Input, Multi-Channel Half-Pitch Phototransistor Optocoupler; DATASHEET: https://docs.broadcom.com/doc/AV02-0752EN; DESCRIPTION: 80V 50mA 400mV@2.4mA,8mA 4 6V 1.2V DC SOP-16-4.4mm Transistor, Photovoltaic Output Optoisolators ROHS; LCSC_PART: C188681
P3ON P5ON P12ON PROC PWR = ds_LED:LED-GREEN; DESCRIPTION: 20mA 810mcd Colorless and transparent Individual diode 515nm~535nm -20℃~+85℃ Positive Stick Emerald 120° 70mW 3.3V 0603 LED Indication - Discrete ROHS; LCSC_PART: C965804
R1 R10 R58 R92 R111 R128 R143 R161 = ds_passive:R
R2 R95 R132 R147 R162 = ds_resistor:10K-1%; DESCRIPTION: 62.5mW Thick Film Resistors 50V ±100ppm/℃ ±1% 10kΩ 0402 Chip Resistor - Surface Mount ROHS; LCSC_PART: C25744
R3 R5 R94 = ds_resistor:100K-1%; DESCRIPTION: 62.5mW Thick Film Resistors 50V ±100ppm/℃ ±1% 100kΩ 0402 Chip Resistor - Surface Mount ROHS; LCSC_PART: C25741
R4 = ds_resistor:9.09K-1%; DESCRIPTION: 62.5mW Thick Film Resistors 50V ±100ppm/℃ ±1% 9.09kΩ 0402 Chip Resistor - Surface Mount ROHS; LCSC_PART: C11549
R6 R12 = ds_resistor:7.5K-1%; DESCRIPTION: 62.5mW Thick Film Resistors 50V ±100ppm/℃ ±1% 7.5kΩ 0402 Chip Resistor - Surface Mount ROHS; LCSC_PART: C25918
R7 R9 = ds_resistor:10R-1%; DESCRIPTION: 62.5mW Thick Film Resistors 50V ±1% ±200ppm/℃ 10Ω 0402 Chip Resistor - Surface Mount ROHS; LCSC_PART: C25077
R8 = ds_resistor:20K-1%; DESCRIPTION: 62.5mW Thick Film Resistors 50V ±100ppm/℃ ±1% 20kΩ 0402 Chip Resistor - Surface Mount ROHS; LCSC_PART: C25765
R11 R13 = ds_resistor:40.2K-1%; DESCRIPTION: 62.5mW Thick Film Resistors 50V ±100ppm/℃ ±1% 40.2kΩ 0402 Chip Resistor - Surface Mount ROHS; LCSC_PART: C25893
R14 = ds_resistor:12.7K-1%; DESCRIPTION: 62.5mW Thick Film Resistors 50V ±100ppm/℃ ±1% 12.7kΩ 0402 Chip Resistor - Surface Mount ROHS; LCSC_PART: C25853
R15 R160 = ds_resistor:27R-1%; DESCRIPTION: 50mW Thick Film Resistors 25V ±1% ±200ppm/℃ 27Ω 0201 Chip Resistor - Surface Mount ROHS; LCSC_PART: C473051
R16 R59 R153-R159 = ds_resistor:1K-1%; DESCRIPTION: 50mW Thick Film Resistors 25V ±1% ±200ppm/℃ 1kΩ 0201 Chip Resistor - Surface Mount ROHS; LCSC_PART: C270365
R17-R24 = ds_resistor:330R-1%; DESCRIPTION: 1W Thick Film Resistors 200V ±100ppm/℃ ±1% 330Ω 2512 Chip Resistor - Surface Mount ROHS; LCSC_PART: C620880
R25-R32 R35 R43 R51 R67 R75 R83 R99 R115 = ds_resistor:0.002R-1%; DESCRIPTION: 3W ±100ppm/℃ ±1% 2mΩ 2512 Chip Resistor - Surface Mount ROHS; LCSC_PART: C728320
R33 R34 R40-R42 R48-R50 R56 R65 R66 R72-R74 R80-R82 R88 R97 R98 R104 R113 R114 R120 = ds_resistor:1K-1%; DESCRIPTION: 125mW Thick Film Resistors 150V ±100ppm/℃ ±1% 1kΩ 0805 Chip Resistor - Surface Mount ROHS; LCSC_PART: C17513
R36-R39 R44-R47 R52-R55 R68-R71 R76-R79 R84-R87 R100-R103 R116-R119 = ds_resistor:470K-1%; DESCRIPTION: 125mW Thick Film Resistors 150V ±100ppm/℃ ±1% 470kΩ 0805 Chip Resistor - Surface Mount ROHS; LCSC_PART: C17709
R57 R91 = ds_resistor:0R; DESCRIPTION: 62.5mW Thick Film Resistors 50V ±800ppm/℃ ±1% 0Ω 0402 Chip Resistor - Surface Mount ROHS; LCSC_PART: C17168
R60 R61 R105 R107 = ds_resistor:4.99K-1%; DESCRIPTION: 100mW Thick Film Resistors 75V ±100ppm/℃ ±1% 4.99kΩ 0603 Chip Resistor - Surface Mount ROHS; LCSC_PART: C23046
R62 R106 = ds_resistor:39R-1%; DESCRIPTION: 2W Thick Film Resistors 200V ±100ppm/℃ ±1% 39Ω 2512 Chip Resistor - Surface Mount ROHS; LCSC_PART: C175263
R63 R64 = ds_resistor:1K-1%_ARRAY; DESCRIPTION: 4 ±1% 1kΩ 62.5mW ±200ppm/℃ 0603x4 Resistor Networks, Arrays ROHS; LCSC_PART: C110021
R89 R90 = ds_resistor:10K-1%_ARRAY; DESCRIPTION: 4 ±1% 10kΩ 62.5mW ±200ppm/℃ 0603x4 Resistor Networks, Arrays ROHS; LCSC_PART: C110924
R93 = Resistor Array:742C083103JP: RES ARRAY 4 RES 10K OHM 1206 Manufacturer's datasheet <https://www.ctscorp.com/wp-content/uploads/74x.pdf>; CREATED_BY: PCBLayout.com; DIGIKEY_PN: 742C083103JPTR-ND; MANUFACTURER: CTS Resistor Products; MPN: 742C083103JP; PACKAGE: 1206
R96 R108 = ds_resistor:10K-1%; DESCRIPTION: 125mW Thick Film Resistors 150V ±100ppm/℃ ±1% 10kΩ 0805 Chip Resistor - Surface Mount ROHS; LCSC_PART: C17414
R109 R129 R145 = ds_resistor:4.7K-1%; DESCRIPTION: 50mW Thick Film Resistors 25V ±1% ±200ppm/℃ 4.7kΩ 0201 Chip Resistor - Surface Mount ROHS; LCSC_PART: C270346
R110 = ds_resistor:1M-1%; DESCRIPTION: 250mW Thick Film Resistors 200V ±100ppm/℃ ±1% 1MΩ 1206 Chip Resistor - Surface Mount ROHS; LCSC_PART: C17927
R112 R122 R123 R151 R163 = ds_resistor:1K-1%; DESCRIPTION: 62.5mW Thick Film Resistors 50V ±100ppm/℃ ±1% 1kΩ 0402 Chip Resistor - Surface Mount ROHS; LCSC_PART: C11702
R121 = ds_resistor:2.2K-1%; DESCRIPTION: 50mW Thick Film Resistors 25V ±1% ±200ppm/℃ 2.2kΩ 0201 Chip Resistor - Surface Mount ROHS; LCSC_PART: C473508
R124 R125 = ds_resistor:5.1K-1%; DESCRIPTION: 50mW Thick Film Resistors 25V ±1% ±200ppm/℃ 5.1kΩ 0201 Chip Resistor - Surface Mount ROHS; LCSC_PART: C274341
R126 R127 = ds_resistor:10K-1%; DESCRIPTION: 50mW Thick Film Resistors 25V ±1% ±200ppm/℃ 10kΩ 0201 Chip Resistor - Surface Mount ROHS; LCSC_PART: C473048
R130 R149 = ds_resistor:3.3K-1%_ARRAY; DESCRIPTION: 4 ±1% 3.3kΩ 62.5mW ±200ppm/℃ 0603x4 Resistor Networks, Arrays ROHS; LCSC_PART: C1734380
R131 = ds_resistor:1M-1%; DESCRIPTION: 62.5mW Thick Film Resistors 50V ±100ppm/℃ ±1% 1MΩ 0402 Chip Resistor - Surface Mount ROHS; LCSC_PART: C26083
R133-R136 = ds_resistor:3.3R-1%; DESCRIPTION: 50mW Thick Film Resistors 25V -200ppm/℃~+400ppm/℃ ±1% 3.3Ω 0201 Chip Resistor - Surface Mount ROHS; LCSC_PART: C158547
R137-R140 = ds_resistor:49.9R-1%; DESCRIPTION: 50mW Thick Film Resistors 25V ±1% ±200ppm/℃ 49.9Ω 0201 Chip Resistor - Surface Mount ROHS; LCSC_PART: C155744
R141 R142 R146 = ds_resistor:470R-1%; DESCRIPTION: 62.5mW Thick Film Resistors 50V ±100ppm/℃ ±1% 470Ω 0402 Chip Resistor - Surface Mount ROHS; LCSC_PART: C25117
R144 = ds_resistor:1M-1%; DESCRIPTION: 50mW Thick Film Resistors 25V ±1% ±200ppm/℃ 1MΩ 0201 Chip Resistor - Surface Mount ROHS; LCSC_PART: C295786
R148 = ds_resistor:2.4K-1%; DESCRIPTION: 62.5mW Thick Film Resistors 50V ±100ppm/℃ ±1% 2.4kΩ 0402 Chip Resistor - Surface Mount ROHS; LCSC_PART: C25882
R150 = ds_resistor:8.2K-1%; DESCRIPTION: 62.5mW Thick Film Resistors 50V ±100ppm/℃ ±1% 8.2kΩ 0402 Chip Resistor - Surface Mount ROHS; LCSC_PART: C25924
R152 = ds_resistor:10R-1%; DESCRIPTION: 50mW Thick Film Resistors 25V ±1% ±200ppm/℃ 10Ω 0201 Chip Resistor - Surface Mount ROHS; LCSC_PART: C270817
REF1 = ds_ic_vreg:LM4040BXX: Fixed voltage, 45-µA, precision micropower shunt voltage reference; DESCRIPTION: 3V ±0.2% 15mA Fixed SOT-23 Voltage Reference ROHS; LCSC_PART: C460604
USB1 = ds_con:USB_C; DESCRIPTION: 3A 1 Horizontal attachment 16P Female -25℃~+85℃ Type-C SMD USB Connectors ROHS; LCSC_PART: C2927038
X1 = ds_passive:CRYSTAL-3225; DESCRIPTION: 12MHz Surface Mount Crystal 20pF ±10ppm ±20ppm SMD3225-4P Crystals ROHS; LCSC_PART: C9002
X2 = ds_passive:CRYSTAL-3225; DESCRIPTION: 25MHz Surface Mount Crystal 12pF ±10ppm ±20ppm SMD3225-4P Crystals ROHS; LCSC_PART: C9006

## Net classes
0 50R_SE: width 0.2 mm, drill 0.2 mm, clearance 0.178 mm
1 100R_DIFFPAIR: width 0.121 mm, drill 0.15 mm, clearance 0.191 mm
2 90R_DIFFPAIR: width 0.155 mm, drill 0.15 mm, clearance 0.191 mm
3 AC_MEA: width 0.406 mm, drill 0.35 mm, clearance 0.203 mm
4 AC_SIG: width 0.305 mm, drill 0.2 mm, clearance 0.35 mm